# Altium project FlexEMG_v0r0.PrjPcb (part 1 of 2)
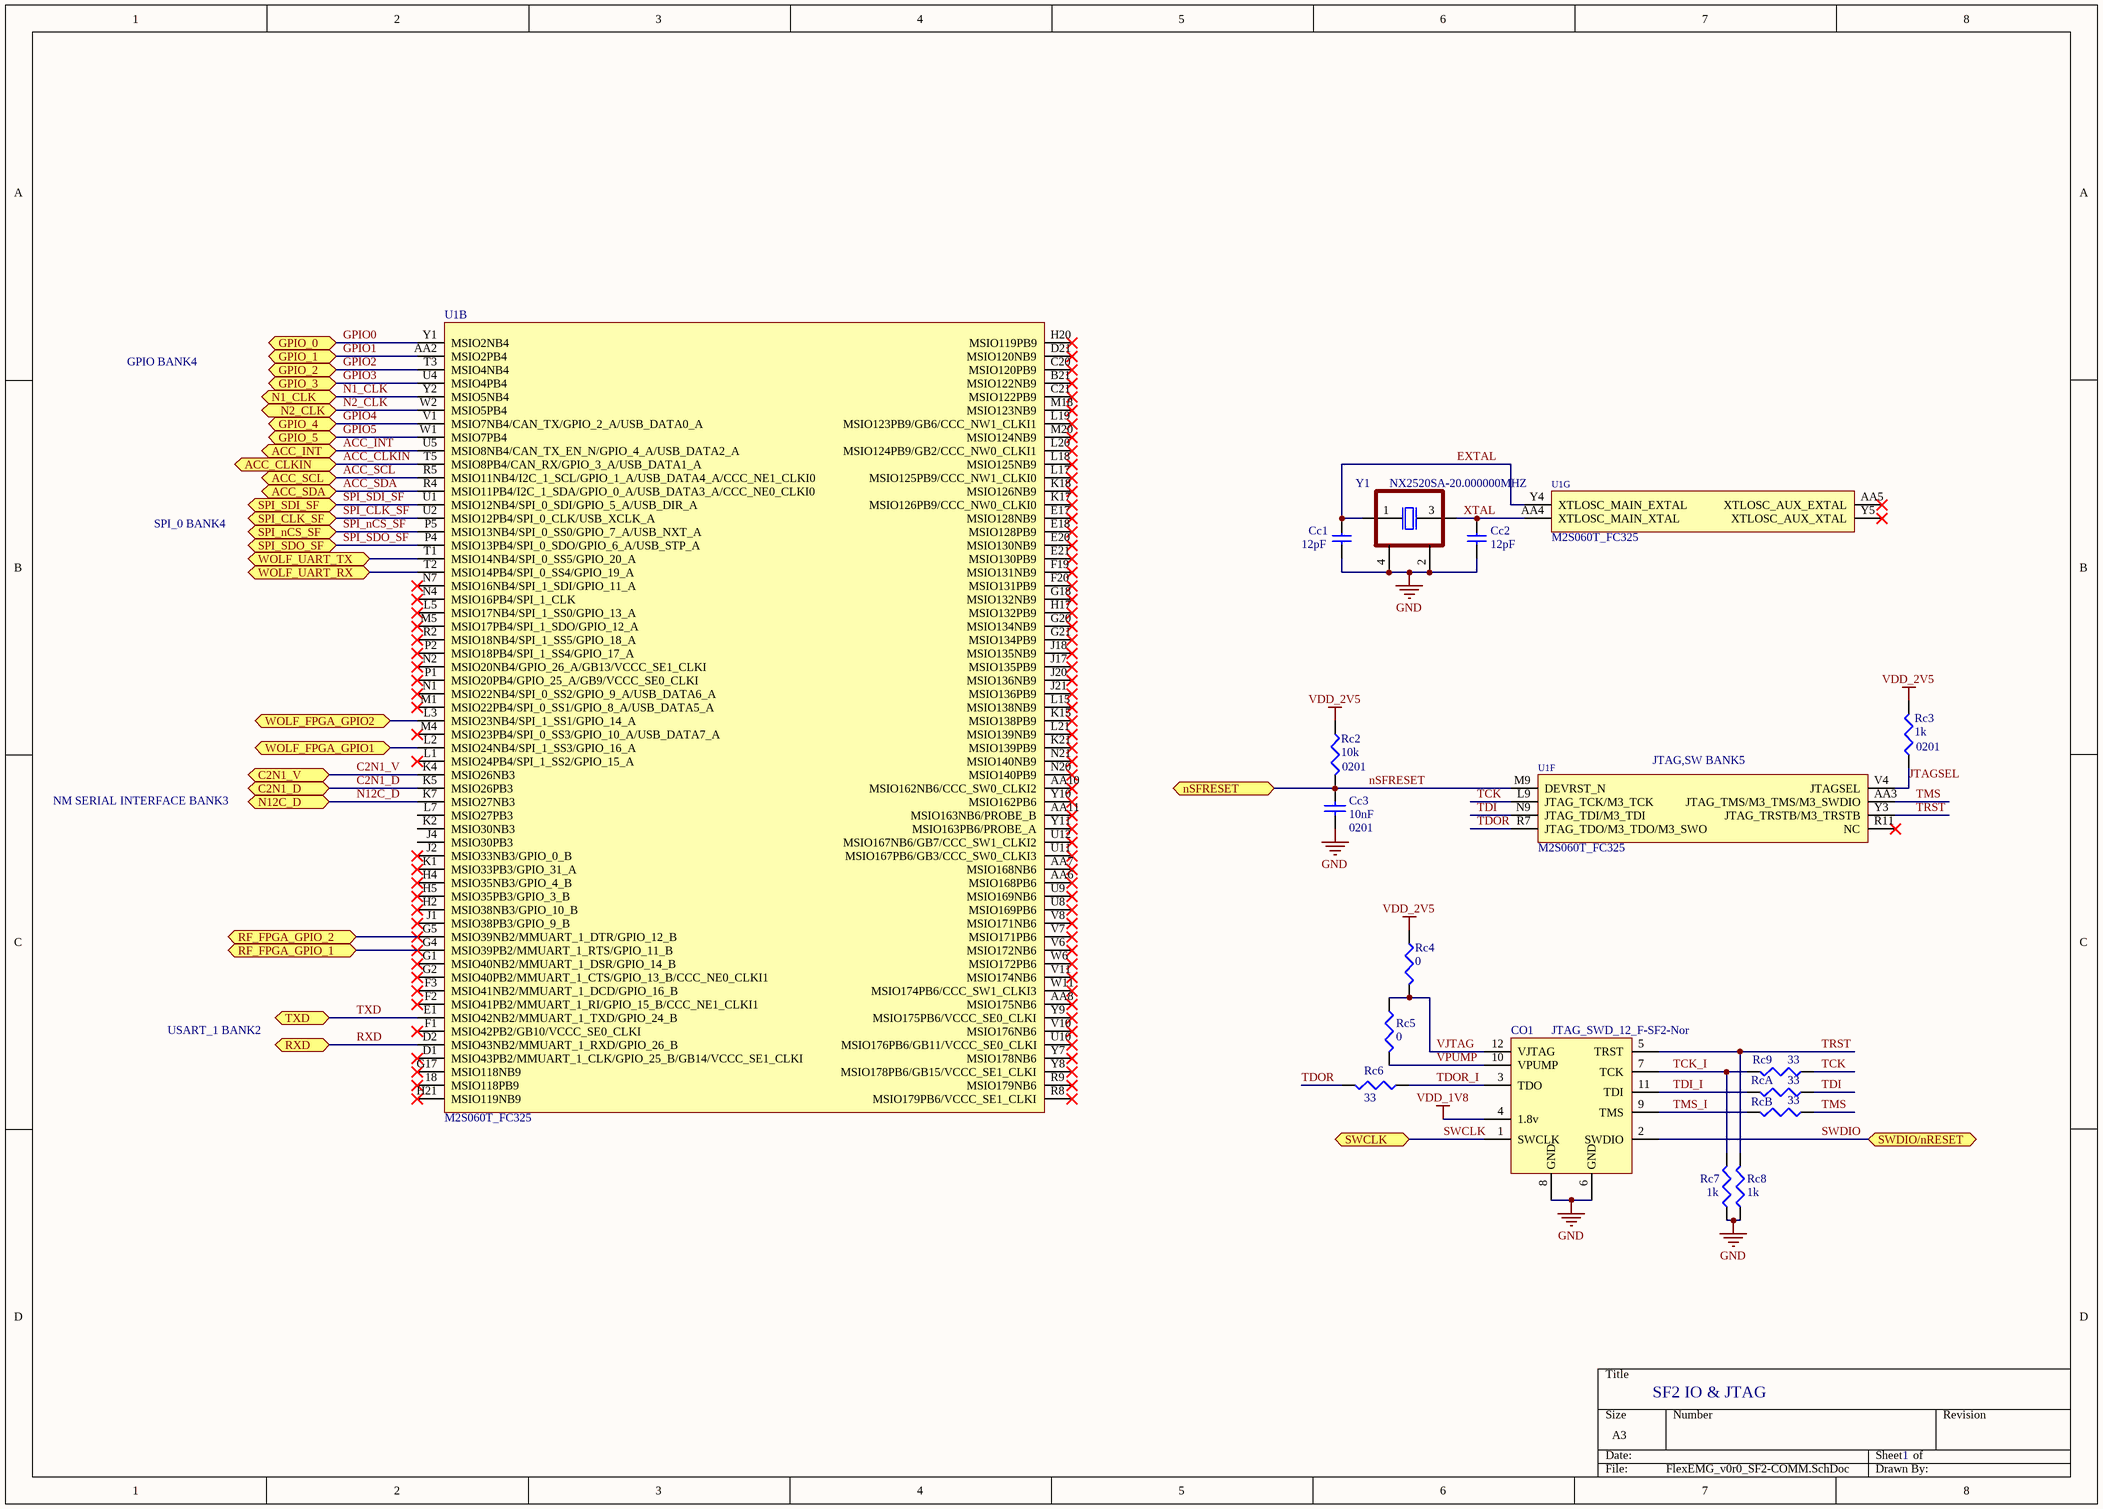
[diagram p0: FlexEMG_v0r0_SF2-COMM.SchDoc]
9 sheets, 200 parts. Net scope: flat (ports and power ports of the same name join across sheets).
Board file: FlexEMG_v0r0.PcbDoc
Sheets:
  FlexEMG_v0r0_SF2-COMM.SchDoc
  FlexEMG_v0r0_SF2_DDR.SchDoc
  FlexEMG_v0r0_SF2-POWER.SchDoc
  FlexEMG_v0r0_SF2_unused.SchDoc
  FlexEMG_v0r0_RADIO.SchDoc
  FlexEMG_v0r0_NM.SchDoc
  FlexEMG_v0r0_ACCEL.SchDoc
  FlexEMG_v0r0_BATT-CHARGER.SchDoc
  FlexEMG_v0r0_POWER-SUPPLIES.SchDoc

## Sheet FlexEMG_v0r0_SF2-COMM.SchDoc
size A3

### Parts
Cc1  value 12pF  [c0402-Murata-GR]  (hidden comment: GRM1555C1H120FA01D)
Cc2  value 12pF  [c0402-Murata-GR]  (hidden comment: GRM1555C1H120FA01D)
Cc3  0201  value 10nF  [c0201-Murata-GR]
CO1  JTAG_SWD_12_F-SF2-Nor  [CONN_12-CLP]
Rc2  value 10k  Package: 0201  [0201_p]  (hidden comment: ERJ-1GEF1002C)
Rc3  value 1k  Package: 0201  [0201_p]  (hidden comment: ERJ-1GEF1001C)
Rc4  value 0  [0402_p]  (hidden comment: ERJ-2GE0R00X)
Rc5  value 0  [0402_p]  (hidden comment: ERJ-2GE0R00X)
Rc6  value 33  [0402_p]  (hidden comment: ERJ-PA2J330X)
Rc7  value 1k  [0402_p]  (hidden comment: ERJ-2RKF1001X)
Rc8  value 1k  [0402_p]  (hidden comment: ERJ-2RKF1001X)
Rc9  value 33  [0402_p]  (hidden comment: ERJ-PA2J330X)
RcA  value 33  [0402_p]  (hidden comment: ERJ-PA2J330X)
RcB  value 33  [0402_p]  (hidden comment: ERJ-PA2J330X)
U1  M2S060T_FC325  [MCSM-CS-325]  (parts B,F,G of 9)
Y1  NX2520SA-20.000000MHZ  [XOSC_4PIN]

### Ports
ACC_CLKIN, ACC_INT, ACC_SCL, ACC_SDA, C2N1_D (bidir), C2N1_V (bidir), GPIO_0, GPIO_1, GPIO_2, GPIO_3, GPIO_4, GPIO_5, N1_CLK (bidir), N2_CLK (bidir), N12C_D (bidir), nSFRESET (bidir), RF_FPGA_GPIO_1 (bidir), RF_FPGA_GPIO_2 (bidir), RXD (bidir), SPI_CLK_SF (bidir), SPI_nCS_SF (bidir), SPI_SDI_SF (bidir), SPI_SDO_SF (bidir), SWCLK (bidir), SWDIO/nRESET (bidir), TXD (bidir), WOLF_FPGA_GPIO1 (bidir), WOLF_FPGA_GPIO2 (bidir), WOLF_UART_RX (bidir), WOLF_UART_TX (bidir)

### Nets
GND: Cc1.1 Cc2.1 Cc3.1 CO1.6(GND) CO1.8(GND) Rc7.1 Rc8.1 Y1.2(GND) Y1.4(GND)
VDD_1V8: CO1.4(1.8v)
VDD_2V5: Rc2.1 Rc3.2 Rc4.1
ACC_CLKIN: U1.T5(MSIO8PB4/CAN_RX/GPIO_3_A/USB_DATA1_A) ; port ACC_CLKIN
ACC_INT: U1.U5(MSIO8NB4/CAN_TX_EN_N/GPIO_4_A/USB_DATA2_A) ; port ACC_INT
ACC_SCL: U1.R5(MSIO11NB4/I2C_1_SCL/GPIO_1_A/USB_DATA4_A/CCC_NE1_CLKI0) ; port ACC_SCL
ACC_SDA: U1.R4(MSIO11PB4/I2C_1_SDA/GPIO_0_A/USB_DATA3_A/CCC_NE0_CLKI0) ; port ACC_SDA
C2N1_D: U1.K5(MSIO26PB3) ; port C2N1_D
C2N1_V: U1.K4(MSIO26NB3) ; port C2N1_V
EXTAL: Cc1.2 U1.Y4(XTLOSC_MAIN_EXTAL) Y1.1(inp)
GPIO0: U1.Y1(MSIO2NB4) ; port GPIO_0
GPIO1: U1.AA2(MSIO2PB4) ; port GPIO_1
GPIO2: U1.T3(MSIO4NB4) ; port GPIO_2
GPIO3: U1.U4(MSIO4PB4) ; port GPIO_3
GPIO4: U1.V1(MSIO7NB4/CAN_TX/GPIO_2_A/USB_DATA0_A) ; port GPIO_4
GPIO5: U1.W1(MSIO7PB4) ; port GPIO_5
JTAGSEL: Rc3.1 U1.V4(JTAGSEL)
N1_CLK: U1.Y2(MSIO5NB4) ; port N1_CLK
N2_CLK: U1.W2(MSIO5PB4) ; port N2_CLK
N12C_D: U1.K7(MSIO27NB3) ; port N12C_D
nSFRESET: Cc3.2 Rc2.2 U1.M9(DEVRST_N) ; port nSFRESET
RXD: U1.D2(MSIO43NB2/MMUART_1_RXD/GPIO_26_B) ; port RXD
SPI_CLK_SF: U1.U2(MSIO12PB4/SPI_0_CLK/USB_XCLK_A) ; port SPI_CLK_SF
SPI_nCS_SF: U1.P5(MSIO13NB4/SPI_0_SS0/GPIO_7_A/USB_NXT_A) ; port SPI_nCS_SF
SPI_SDI_SF: U1.U1(MSIO12NB4/SPI_0_SDI/GPIO_5_A/USB_DIR_A) ; port SPI_SDI_SF
SPI_SDO_SF: U1.P4(MSIO13PB4/SPI_0_SDO/GPIO_6_A/USB_STP_A) ; port SPI_SDO_SF
SWCLK: CO1.1(SWCLK) ; port SWCLK
SWDIO: CO1.2(SWDIO) ; port SWDIO/nRESET
TCK: Rc9.1 U1.L9(JTAG_TCK/M3_TCK)
TCK_I: CO1.7(TCK) Rc7.2 Rc9.2
TDI: RcA.1 U1.N9(JTAG_TDI/M3_TDI)
TDI_I: CO1.11(TDI) RcA.2
TDOR: Rc6.2 U1.R7(JTAG_TDO/M3_TDO/M3_SWO)
TDOR_I: CO1.3(TDO) Rc6.1
TMS: RcB.1 U1.AA3(JTAG_TMS/M3_TMS/M3_SWDIO)
TMS_I: CO1.9(TMS) RcB.2
TRST: CO1.5(TRST) Rc8.2 U1.Y3(JTAG_TRSTB/M3_TRSTB)
TXD: U1.E1(MSIO42NB2/MMUART_1_TXD/GPIO_24_B) ; port TXD
VJTAG: CO1.12(VJTAG) Rc4.2 Rc5.1
VPUMP: CO1.10(VPUMP) Rc5.2
XTAL: Cc2.2 U1.AA4(XTLOSC_MAIN_XTAL) Y1.3(out)
NetU1_G4: U1.G4(MSIO39PB2/MMUART_1_RTS/GPIO_11_B) ; port RF_FPGA_GPIO_1
NetU1_G5: U1.G5(MSIO39NB2/MMUART_1_DTR/GPIO_12_B) ; port RF_FPGA_GPIO_2
NetU1_L2: U1.L2(MSIO24NB4/SPI_1_SS3/GPIO_16_A) ; port WOLF_FPGA_GPIO1
NetU1_L3: U1.L3(MSIO23NB4/SPI_1_SS1/GPIO_14_A) ; port WOLF_FPGA_GPIO2
NetU1_T1: U1.T1(MSIO14NB4/SPI_0_SS5/GPIO_20_A) ; port WOLF_UART_TX
NetU1_T2: U1.T2(MSIO14PB4/SPI_0_SS4/GPIO_19_A) ; port WOLF_UART_RX

Not connected (* = marked no-connect by the designer): U1 18(MSIO118PB9)* AA5(XTLOSC_AUX_EXTAL)* AA6(MSIO168PB6)* AA7(MSIO168NB6)* AA8(MSIO175NB6)* AA10(MSIO162NB6/CCC_SW0_CLKI2)* AA11(MSIO163NB6/PROBE_B)* B21(MSIO122NB9)* C20(MSIO120PB9)* C21(MSIO122PB9)* D1(MSIO43PB2/MMUART_1_CLK/GPIO_25_B/GB14/VCCC_SE1_CLKI)* D21(MSIO120NB9)* E17(MSIO128NB9)* E18(MSIO128PB9)* E20(MSIO130NB9)* E21(MSIO130PB9)* F1(MSIO42PB2/GB10/VCCC_SE0_CLKI)* F2(MSIO41PB2/MMUART_1_RI/GPIO_15_B/CCC_NE1_CLKI1)* F3(MSIO41NB2/MMUART_1_DCD/GPIO_16_B)* F19(MSIO131NB9)* F20(MSIO131PB9)* G1(MSIO40NB2/MMUART_1_DSR/GPIO_14_B)* G2(MSIO40PB2/MMUART_1_CTS/GPIO_13_B/CCC_NE0_CLKI1)* G17(MSIO118NB9)* G18(MSIO132NB9)* G20(MSIO134NB9)* G21(MSIO134PB9)* H2(MSIO38NB3/GPIO_10_B)* H4(MSIO35NB3/GPIO_4_B)* H5(MSIO35PB3/GPIO_3_B)* H17(MSIO132PB9)* H20(MSIO119PB9)* H21(MSIO119NB9)* J1(MSIO38PB3/GPIO_9_B)* J2(MSIO33NB3/GPIO_0_B)* J4(MSIO30PB3) J17(MSIO135PB9)* J18(MSIO135NB9)* J20(MSIO136NB9)* J21(MSIO136PB9)* K1(MSIO33PB3/GPIO_31_A)* K2(MSIO30NB3) K15(MSIO138PB9)* K17(MSIO126PB9/CCC_NW0_CLKI0)* K18(MSIO126NB9)* K21(MSIO139PB9)* L1(MSIO24PB4/SPI_1_SS2/GPIO_15_A)* L5(MSIO17NB4/SPI_1_SS0/GPIO_13_A)* L7(MSIO27PB3) L15(MSIO138NB9)* L17(MSIO125PB9/CCC_NW1_CLKI0)* L18(MSIO125NB9)* L19(MSIO123PB9/GB6/CCC_NW1_CLKI1)* L20(MSIO124PB9/GB2/CCC_NW0_CLKI1)* L21(MSIO139NB9)* M1(MSIO22PB4/SPI_0_SS1/GPIO_8_A/USB_DATA5_A)* M4(MSIO23PB4/SPI_0_SS3/GPIO_10_A/USB_DATA7_A)* M5(MSIO17PB4/SPI_1_SDO/GPIO_12_A)* M18(MSIO123NB9)* M20(MSIO124NB9)* N1(MSIO22NB4/SPI_0_SS2/GPIO_9_A/USB_DATA6_A)* N2(MSIO20NB4/GPIO_26_A/GB13/VCCC_SE1_CLKI)* N4(MSIO16PB4/SPI_1_CLK)* N7(MSIO16NB4/SPI_1_SDI/GPIO_11_A)* N20(MSIO140PB9)* N21(MSIO140NB9)* P1(MSIO20PB4/GPIO_25_A/GB9/VCCC_SE0_CLKI)* P2(MSIO18PB4/SPI_1_SS4/GPIO_17_A)* R2(MSIO18NB4/SPI_1_SS5/GPIO_18_A)* R8(MSIO179PB6/VCCC_SE1_CLKI)* R9(MSIO179NB6)* R11(NC)* U8(MSIO169PB6)* U9(MSIO169NB6)* U10(MSIO176PB6/GB11/VCCC_SE0_CLKI)* U11(MSIO167PB6/GB3/CCC_SW0_CLKI3)* U12(MSIO167NB6/GB7/CCC_SW1_CLKI2)* V6(MSIO172NB6)* V7(MSIO171PB6)* V8(MSIO171NB6)* V10(MSIO176NB6)* V11(MSIO174NB6)* W6(MSIO172PB6)* W11(MSIO174PB6/CCC_SW1_CLKI3)* Y5(XTLOSC_AUX_XTAL)* Y7(MSIO178NB6)* Y8(MSIO178PB6/GB15/VCCC_SE1_CLKI)* Y9(MSIO175PB6/VCCC_SE0_CLKI)* Y10(MSIO162PB6)* Y11(MSIO163PB6/PROBE_A)*

### Notes on the sheet
- GPIO BANK4
- SPI_0 BANK4
- (near U1) JTAG,SW BANK5
- NM SERIAL INTERFACE BANK3
- USART_1 BANK2
- SF2 IO & JTAG
- 1

### Library data of the parts
Cc1 Cc2 = CAP_0402: CAP CER 12PF 50V NP0 0402; Manufacturer: Murata; Supplier: Digikey; Manufacturer PN: GRM1555C1H120FA01D; Supplier PN: 490-6196-1-ND
Cc3 = Cap: CAP CER 10000PF 25V X5R 0201; Manufacturer: Murata; Manufacturer PN: GRM033R61E103KA12D; Supplier: Digikey; Supplier PN: 490-7194-1-ND
CO1 = JTAG_SWD_12_F-SF2-Nor: 12 pin female JTAG/SWD header for SmartFusion2 and Nordic; Manufacturer: Samtec; Manufacturer PN: CLP-106-02-x-D; Supplier: Digikey; Supplier PN: SAM1153-06-ND
Rc2 = Resistor: RES SMD 10K OHM 1% 1/20W 0201; Manufacturer: Panasonic; Manufacturer PN: ERJ-1GEF1002C; Supplier: Digikey; Supplier P/N: P10.0KABCT-ND; Power: 1/20W
Rc3 = Resistor: RES SMD 1K OHM 1% 1/20W 0201; Manufacturer: Panasonic; Manufacturer PN: ERJ-1GEF1001C; Supplier: Digikey; Supplier P/N: P1.00KABCT-ND; Power: 1/20W
Rc4 Rc5 = Resistor: RES SMD 0.0OHM JUMPER 1/10W 0402; Manufacturer: Panasonic; Manufacturer PN: ERJ-2GE0R00X; Supplier: Digikey; Power: 1/10W; Supplier P/N: P0.0JCT-ND; Package: 0402
Rc6 Rc9 RcA RcB = Resistor: RES SMD 33 OHM 1% 1/10W 0402; Manufacturer: Panasonic; Power: 1/5W; Manufacturer PN: ERJ-PA2J330X; Supplier: Digikey; Supplier P/N: P17184CT-ND; Package: 0402
Rc7 Rc8 = Resistor: RES SMD 1K OHM 1% 1/10W 0402; Manufacturer: Panasonic; Manufacturer PN: ERJ-2RKF1001X; Supplier: Digikey; Supplier P/N: P1.00KLCT-ND; Power: 1/10W; Package: 0402
U1 = M2S060T_FC325: SmartFusion2; Manufacturer PN: M2S060T-CS325; Manufacturer: Microsemi; Supplier: Future; Supplier PN: M2S060T-FCSG325I
Y1 = XOSC: CRYSTAL 20.0000MHZ 10PF SMD; Manufacturer: NDK; Supplier PN: 644-1060-6-ND; Supplier: Digikey; Manufacturer PN: NX2520SA-20.000000MHZ

## Sheet FlexEMG_v0r0_SF2_DDR.SchDoc
size A3
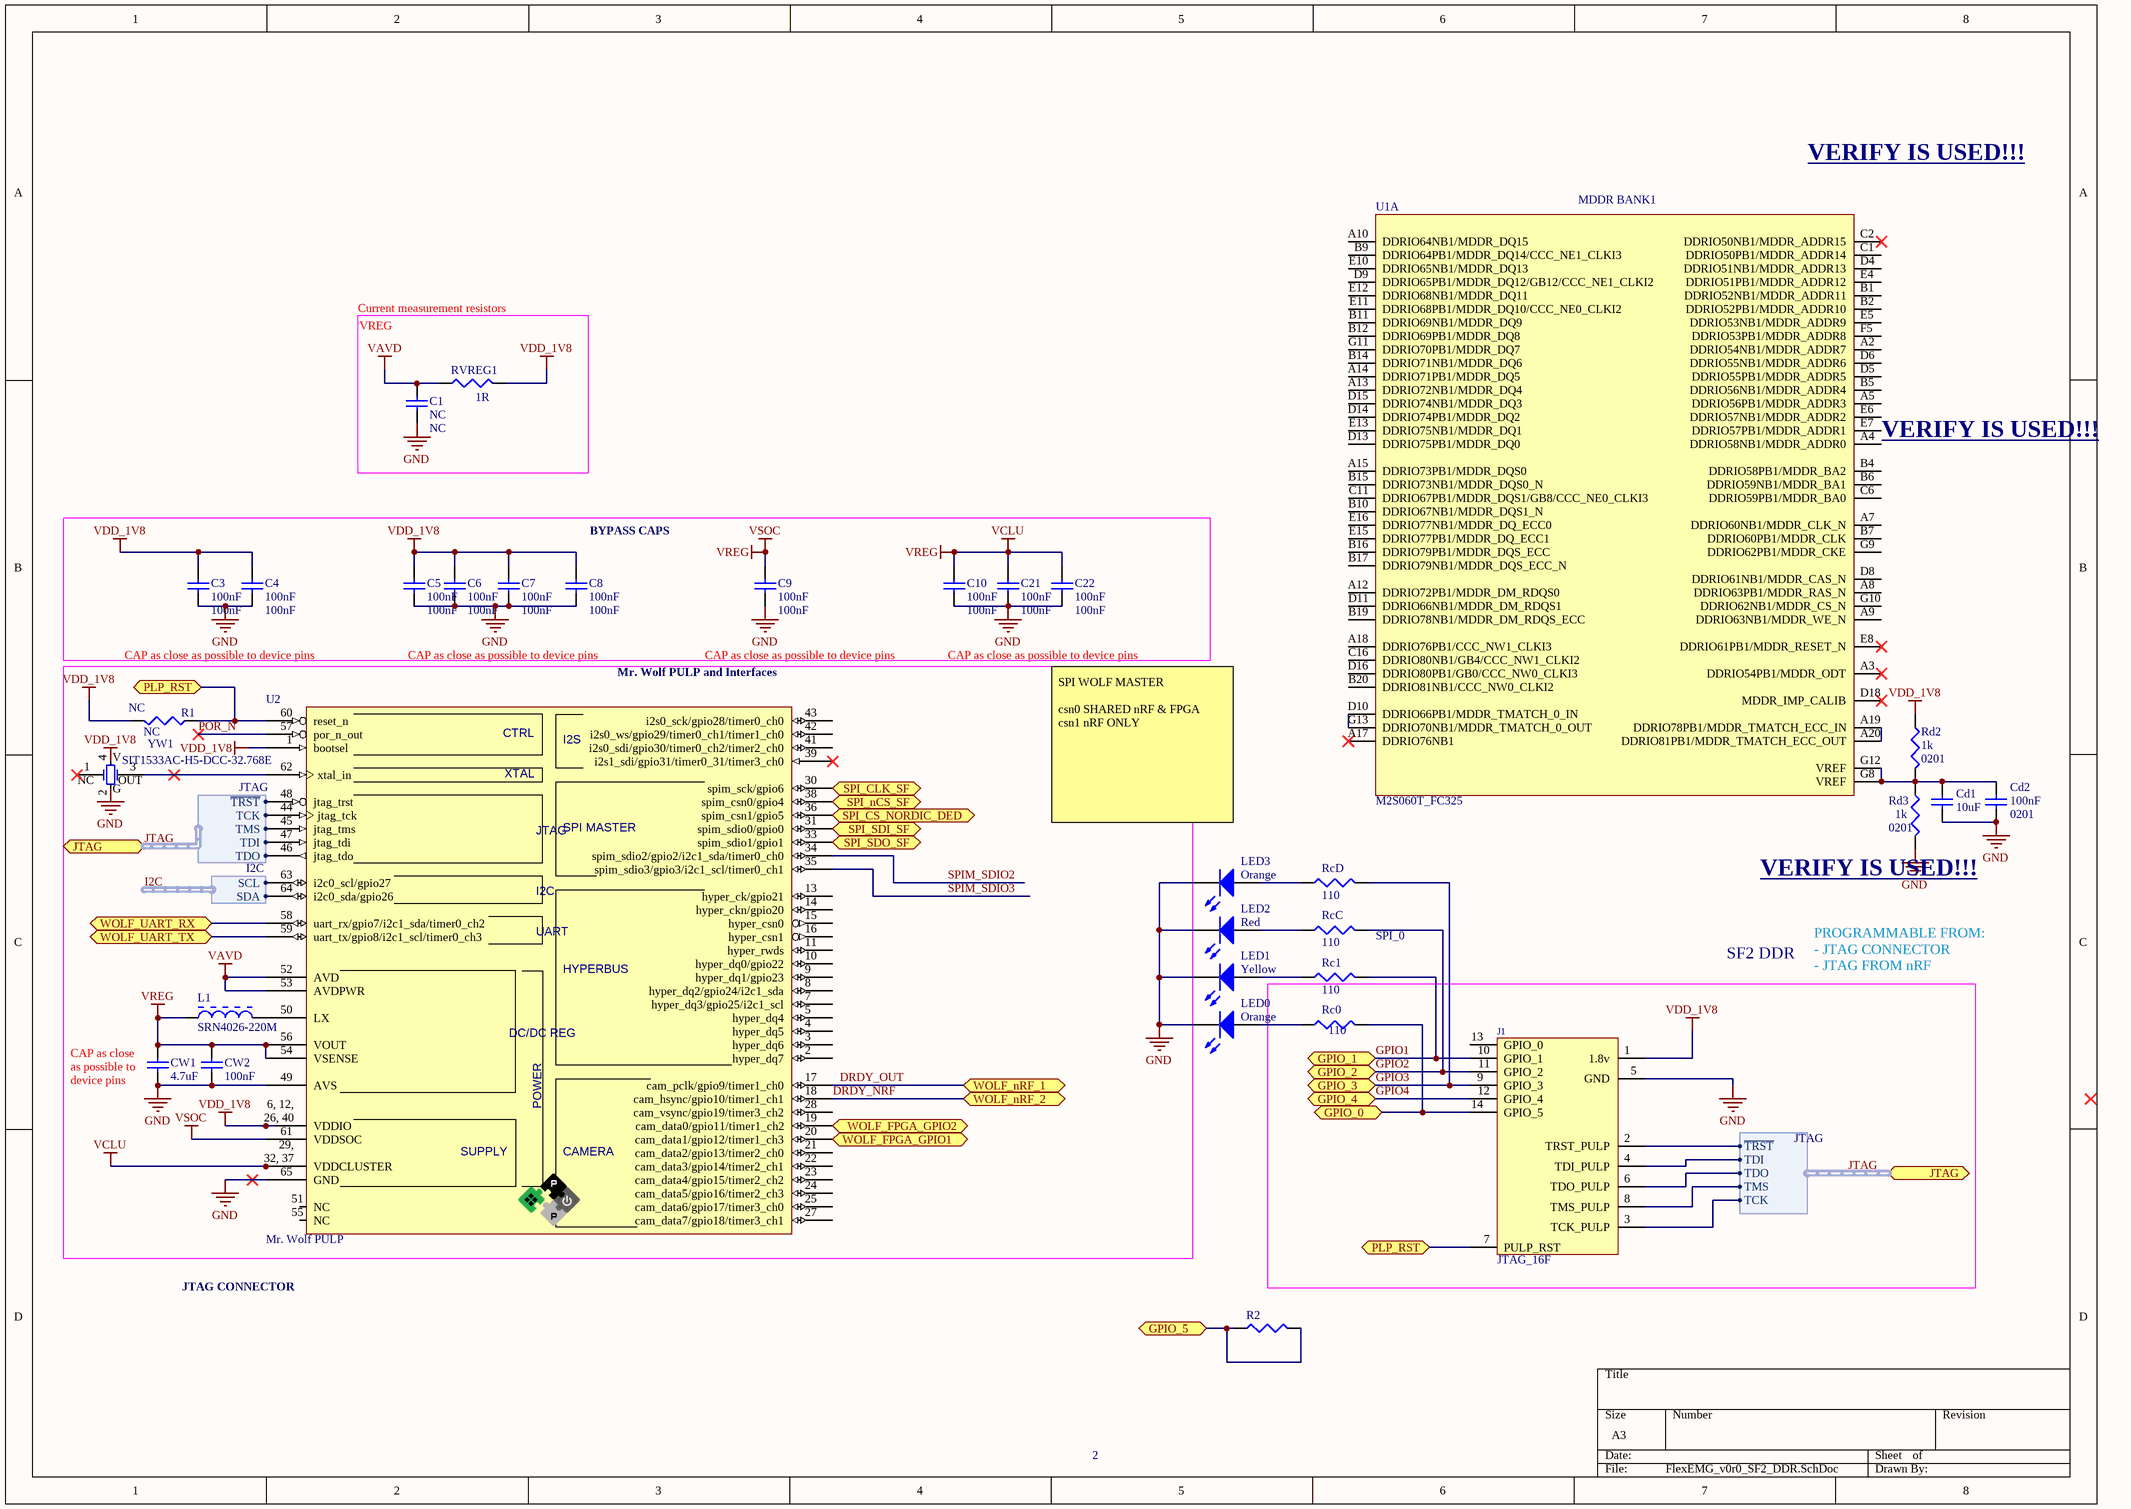
[diagram p1: FlexEMG_v0r0_SF2_DDR.SchDoc]

### Parts
C1  NC  [J1-0603]
C3  100nF  [0402]
C4  100nF  [0402_ss]
C5  100nF  [0402]
C6  100nF  [0402]
C7  100nF  [0402]
C8  100nF  [0402]
C9  100nF  [0402]
C10  100nF  [0402]
C21  100nF  [0402]
C22  100nF  [0402]
Cd1  value 10uF  [c0603-Murata-GR]  (hidden comment: GRM188R61E106MA73D)
Cd2  value 100nF  Package: 0201  [c0201-Murata-GR]  (hidden comment: GRM033R6YA104KE14D)
CW1  4.7uF  [0402]
CW2  100nF  [0402]
J1  JTAG_16F  [CONN_16-CLP]
L1  SRN4026-220M  [BOUR-IND-SRN4026]
LED0  Color: Orange  [LED-0603]
LED1  Color: Yellow  [LED-0603]
LED2  Color: Red  [LED-0603]
LED3  Color: Orange  [LED-0603]
R1  NC  [0402]
R2  (no value)  [0603]
Rc0  value 110  [0201_p]  (hidden comment: ERJ-2RKF1100X)
Rc1  value 110  [0201_p]  (hidden comment: ERJ-2RKF1100X)
RcC  value 110  [0201_p]  (hidden comment: ERJ-2RKF1100X)
RcD  value 110  [0201_p]  (hidden comment: ERJ-2RKF1100X)
Rd2  value 1k  Package: 0201  [0201_p]  (hidden comment: ERJ-1GEF1001C)
Rd3  value 1k  Package: 0201  [0201_p]  (hidden comment: ERJ-1GEF1001C)
RVREG1  value 1R  [J1-0603]
U1  M2S060T_FC325  [MCSM-CS-325]  (part A of 9)
U2  Mr. Wolf PULP  [QFN50P900X900X100_HS_NOVIAS_65M]
YW1  SIT1533AC-H5-DCC-32.768E  [SiT1533-C]

### Blocks framed on the sheet
BYPASS CAPS: C3-C10 C21 C22
Mr. Wolf PULP and Interfaces: CW1 CW2 L1 R1 U2 YW1

### Ports
GPIO_0, GPIO_1, GPIO_2, GPIO_3, GPIO_4, GPIO_5, JTAG (harness JTAG), PLP_RST (bidir), SPI_CLK_SF (bidir), SPI_CS_NORDIC_DED (bidir), SPI_nCS_SF (bidir), SPI_SDI_SF (bidir), SPI_SDO_SF (bidir), WOLF_FPGA_GPIO1 (bidir), WOLF_FPGA_GPIO2 (bidir), WOLF_nRF_1 (bidir), WOLF_nRF_2 (bidir), WOLF_UART_RX (bidir), WOLF_UART_TX (bidir)

### Harnesses
JTAG: ~{TRST}, TCK, TMS, TDI, TDO
I2C: SCL, SDA

### Nets
GND: C1.1 C3.1 C4.1 C5.1 C6.1 C7.1 C8.1 C9.1 C10.1 C21.1 C22.1 Cd1.1 Cd2.1 CW1.1 CW2.1 J1.5(GND) LED0.2(K) LED1.2(K) LED2.2(K) LED3.2(K) Rd3.2 U2.49(AVS) U2.65(GND) YW1.2(GND)
VAVD: C1.2 RVREG1.1 U2.52(AVD) U2.53(AVDPWR)
VCLU: C9.2 C10.2 C21.2 C22.2 CW1.2 CW2.2 L1.1 U2.29(VDDCLUSTER) U2.32(VDDCLUSTER) U2.37(VDDCLUSTER) U2.54(VSENSE) U2.56(VOUT) U2.61(VDDSOC)  [also labelled VREG, VSOC]
VDD_1V8: C3.2 C4.2 C5.2 C6.2 C7.2 C8.2 J1.1(1.8v) R1.2 Rd2.1 RVREG1.2 U2.1(bootsel) U2.6(VDDIO) U2.12(VDDIO) U2.26(VDDIO) U2.40(VDDIO) YW1.4(VDD)
DRDY_NRF: U2.18(cam_hsync/gpio10/timer1_ch1) ; port WOLF_nRF_2
DRDY_OUT: U2.17(cam_pclk/gpio9/timer1_ch0) ; port WOLF_nRF_1
GPIO0: J1.14(GPIO_5) Rc0.2 ; port GPIO_0
GPIO1: J1.10(GPIO_1) Rc1.2 ; port GPIO_1
GPIO2: J1.11(GPIO_2) RcC.2 ; port GPIO_2
GPIO3: J1.9(GPIO_3) RcD.2 ; port GPIO_3
GPIO4: J1.12(GPIO_4) ; port GPIO_4
GPIO5: R2.1 R2.2 ; port GPIO_5
I2C.SCL: U2.63(i2c0_scl/gpio27) ; harness I2C.SCL
I2C.SDA: U2.64(i2c0_sda/gpio26) ; harness I2C.SDA
JTAG.~{TRST}: J1.2(TRST_PULP) U2.48(jtag_trst) ; port JTAG.~{TRST}
JTAG.TCK: J1.3(TCK_PULP) U2.44(jtag_tck) ; port JTAG.TCK
JTAG.TDI: J1.4(TDI_PULP) U2.47(jtag_tdi) ; port JTAG.TDI
JTAG.TDO: J1.6(TDO_PULP) U2.46(jtag_tdo) ; port JTAG.TDO
JTAG.TMS: J1.8(TMS_PULP) U2.45(jtag_tms) ; port JTAG.TMS
POR_N: U2.57(por_n_out)
SPI_CLK_SF: U2.30(spim_sck/gpio6) ; port SPI_CLK_SF
SPI_nCS_SF: U2.38(spim_csn0/gpio4) ; port SPI_nCS_SF
SPI_SDI_SF: U2.31(spim_sdio0/gpio0) ; port SPI_SDI_SF
SPI_SDO_SF: U2.33(spim_sdio1/gpio1) ; port SPI_SDO_SF
SPIM_SDIO2: U2.34(spim_sdio2/gpio2/i2c1_sda/timer0_ch0)
SPIM_SDIO3: U2.35(spim_sdio3/gpio3/i2c1_scl/timer0_ch1)
NetCd1_2: Cd1.2 Cd2.2 Rd2.2 Rd3.1 U1.G8(VREF) U1.G12(VREF)
NetJ1_7: J1.7(PULP_RST) R1.1 U2.60(reset_n) ; port PLP_RST
NetL1_2: L1.2 U2.50(LX)
NetLED0_1: LED0.1(A) Rc0.1
NetLED1_1: LED1.1(A) Rc1.1
NetLED2_1: LED2.1(A) RcC.1
NetLED3_1: LED3.1(A) RcD.1
NetU1_A19: U1.A19(DDRIO78PB1/MDDR_TMATCH_ECC_IN) U1.A20(DDRIO81PB1/MDDR_TMATCH_ECC_OUT)
NetU1_D10: U1.D10(DDRIO66PB1/MDDR_TMATCH_0_IN) U1.G13(DDRIO70NB1/MDDR_TMATCH_0_OUT)
NetU1_L2: U2.20(cam_data1/gpio12/timer1_ch3) ; port WOLF_FPGA_GPIO1
NetU1_L3: U2.19(cam_data0/gpio11/timer1_ch2) ; port WOLF_FPGA_GPIO2
NetU1_T1: U2.59(uart_tx/gpio8/i2c1_scl/timer0_ch3) ; port WOLF_UART_TX
NetU1_T2: U2.58(uart_rx/gpio7/i2c1_sda/timer0_ch2) ; port WOLF_UART_RX
NetU2_36: U2.36(spim_csn1/gpio5) ; port SPI_CS_NORDIC_DED
NetU2_62: U2.62(xtal_in) YW1.3(OUT)

Not connected (* = marked no-connect by the designer): J1 13(GPIO_0); U1 A2(DDRIO54NB1/MDDR_ADDR7) A3(DDRIO54PB1/MDDR_ODT)* A4(DDRIO58NB1/MDDR_ADDR0) A5(DDRIO56PB1/MDDR_ADDR3) A7(DDRIO60NB1/MDDR_CLK_N) A8(DDRIO63PB1/MDDR_RAS_N) A9(DDRIO63NB1/MDDR_WE_N) A10(DDRIO64NB1/MDDR_DQ15) A12(DDRIO72PB1/MDDR_DM_RDQS0) A13(DDRIO72NB1/MDDR_DQ4) A14(DDRIO71PB1/MDDR_DQ5) A15(DDRIO73PB1/MDDR_DQS0) A17(DDRIO76NB1)* A18(DDRIO76PB1/CCC_NW1_CLKI3) B1(DDRIO52NB1/MDDR_ADDR11) B2(DDRIO52PB1/MDDR_ADDR10) B4(DDRIO58PB1/MDDR_BA2) B5(DDRIO56NB1/MDDR_ADDR4) B6(DDRIO59NB1/MDDR_BA1) B7(DDRIO60PB1/MDDR_CLK) B9(DDRIO64PB1/MDDR_DQ14/CCC_NE1_CLKI3) B10(DDRIO67NB1/MDDR_DQS1_N) B11(DDRIO69NB1/MDDR_DQ9) B12(DDRIO69PB1/MDDR_DQ8) B14(DDRIO71NB1/MDDR_DQ6) B15(DDRIO73NB1/MDDR_DQS0_N) B16(DDRIO79PB1/MDDR_DQS_ECC) B17(DDRIO79NB1/MDDR_DQS_ECC_N) B19(DDRIO78NB1/MDDR_DM_RDQS_ECC) B20(DDRIO81NB1/CCC_NW0_CLKI2) C1(DDRIO50PB1/MDDR_ADDR14) C2(DDRIO50NB1/MDDR_ADDR15)* C6(DDRIO59PB1/MDDR_BA0) C11(DDRIO67PB1/MDDR_DQS1/GB8/CCC_NE0_CLKI3) C16(DDRIO80NB1/GB4/CCC_NW1_CLKI2) D4(DDRIO51NB1/MDDR_ADDR13) D5(DDRIO55PB1/MDDR_ADDR5) D6(DDRIO55NB1/MDDR_ADDR6) D8(DDRIO61NB1/MDDR_CAS_N) D9(DDRIO65PB1/MDDR_DQ12/GB12/CCC_NE1_CLKI2) D11(DDRIO66NB1/MDDR_DM_RDQS1) D13(DDRIO75PB1/MDDR_DQ0) D14(DDRIO74PB1/MDDR_DQ2) D15(DDRIO74NB1/MDDR_DQ3) D16(DDRIO80PB1/GB0/CCC_NW0_CLKI3) D18(MDDR_IMP_CALIB)* E4(DDRIO51PB1/MDDR_ADDR12) E5(DDRIO53NB1/MDDR_ADDR9) E6(DDRIO57NB1/MDDR_ADDR2) E7(DDRIO57PB1/MDDR_ADDR1) E8(DDRIO61PB1/MDDR_RESET_N)* E10(DDRIO65NB1/MDDR_DQ13) E11(DDRIO68PB1/MDDR_DQ10/CCC_NE0_CLKI2) E12(DDRIO68NB1/MDDR_DQ11) E13(DDRIO75NB1/MDDR_DQ1) E15(DDRIO77PB1/MDDR_DQ_ECC1) E16(DDRIO77NB1/MDDR_DQ_ECC0) F5(DDRIO53PB1/MDDR_ADDR8) G9(DDRIO62PB1/MDDR_CKE) G10(DDRIO62NB1/MDDR_CS_N) G11(DDRIO70PB1/MDDR_DQ7); U2 2(hyper_dq7) 3(hyper_dq6) 4(hyper_dq5) 5(hyper_dq4) 7(hyper_dq3/gpio25/i2c1_scl) 8(hyper_dq2/gpio24/i2c1_sda) 9(hyper_dq1/gpio23) 10(hyper_dq0/gpio22) 11(hyper_rwds) 13(hyper_ck/gpio21) 14(hyper_ckn/gpio20) 15(hyper_csn0) 16(hyper_csn1) 21(cam_data2/gpio13/timer2_ch0) 22(cam_data3/gpio14/timer2_ch1) 23(cam_data4/gpio15/timer2_ch2) 24(cam_data5/gpio16/timer2_ch3) 25(cam_data6/gpio17/timer3_ch0) 27(cam_data7/gpio18/timer3_ch1) 28(cam_vsync/gpio19/timer3_ch2) 39(i2s1_sdi/gpio31/timer0_31/timer3_ch0)* 41(i2s0_sdi/gpio30/timer0_ch2/timer2_ch0) 42(i2s0_ws/gpio29/timer0_ch1/timer1_ch0) 43(i2s0_sck/gpio28/timer0_ch0) 51(NC) 55(NC); YW1 1(NC)*

### Buses and harness runs
harness JTAG = port JTAG

### Notes on the sheet
- VERIFY IS USED!!!
- (near U1) MDDR BANK1
- Current measurement resistors
- VREG
- (near U1) VERIFY IS USED!!!
- CAP as close as possible to device pins
- SPI WOLF MASTER
  csn0 SHARED nRF & FPGA
  csn1 nRF ONLY
- (near Rd3) VERIFY IS USED!!!
- (near RcC) SPI_0
- SF2 DDR
- PROGRAMMABLE FROM:
  - JTAG CONNECTOR
  - JTAG FROM nRF
- (near CW1) CAP as close as possible to device pins
- JTAG CONNECTOR
- 2
- (in symbol PULP_MR_WOLF) CTRL; I2S; XTAL; JTAG; SPI MASTER; I2C; UART; HYPERBUS; DC/DC REG; POWER; 6, 12,; 26, 40; 29,; SUPPLY; CAMERA; 32, 37
- (in symbol SIT-OSC32KHZ-SIT1533AC-H5-DCC-32.768) V; G

### Library data of the parts
C1 C3-C10 C21 C22 = Cap Semi: Capacitor (Semiconductor SIM Model); Published: 8-Jun-2000; LatestRevisionDate: 29-May-2009; LatestRevisionNote: IPC-7351 Footprint Added.; PackageReference: C1206; Publisher: Altium Limited; PackageDescription: Chip Capacitor
  C1: Value: NC
  C3-C10 C21 C22: Value: 100nF
Cd1 = Cap: CAP CER 10UF 25V X5R 0603 20%; Manufacturer: Murata; Supplier: Digikey; Supplier PN: 490-7202-1-ND; Manufacturer PN: GRM188R61E106MA73D
Cd2 = Cap: CAP CER 0.1UF 16V X7S 0201; Manufacturer: Murata; Note: 35V 10% X5R; Supplier PN: 490-10430-1-ND; Supplier: Digikey; Manufacturer PN: GRM033R6YA104KE14D
CW1 CW2 = Cap Semi: Capacitor (Semiconductor SIM Model); Value: 100pF; Published: 8-Jun-2000; LatestRevisionDate: 29-May-2009; LatestRevisionNote: IPC-7351 Footprint Added.; PackageReference: C1206; Publisher: Altium Limited; PackageDescription: Chip Capacitor
J1 = JTAG_16F: 12 pin female JTAG/SWD header for SmartFusion2 and Nordic; Manufacturer: Samtec; Manufacturer PN: CLP-105-02-x-D; Supplier: Digikey; Supplier PN: SAM1153-05-ND
L1 = BOUR-IND-SRN4026-220M: Semi-shielded Power Inductor, 22uH, 3A; Manufacturer: Bourns; Core Material: Ferrite; Tolerance: 20%; Current Rating: 670mA; DC Resistance (DCR): 234mR; Self Resonant Frequency: 16MHz; Test Frequency: 100kHz; ComponentLink1URL: https://www.bourns.com/docs/Product-Datasheets/SRN4026.pdf; ComponentLink1Description: Datasheet; Supplier 1: RSComponents; Supplier Part Number 1: 813-5643P; Manufacturer Part Number: SRN4026-220M; Stock 1: 2770; Pricing 1: 100=0.209, 500=0.176, 3000=0.135, 6000=0.132 (EUR); Mount: Surface Mount; Case/Package: Nonstandard; Weight: 0.004938oz; Min Operating Temperature: -40°C; Max Operating Temperature: 125°C; Packaging: Tape and Reel; Composition: Wirewound; Inductance: 22uh; Saturation Current: 670mA; Shielding: Shielded; Max DC Current: 670mA; Termination: SMD/SMT; RMS Current (Irms): 670mA; Inductance Tolerance: 20%; Package Quantity: 3000; Length: 4mm; Height: 2.5mm; Width: 4mm; Height - Seated (Max): 0.098inch; Depth: 4mm; REACH SVHC: No SVHC; ComponentLink2URL: https://datasheet.ciiva.com/48684/srn4026-48684665.pdf; ComponentLink2Description: https://datasheet.ciiva.com/48684/srn4026-48684665.pdf; ComponentLink3URL: https://datasheet.ciiva.com/46641/70371276-46641103.pdf; ComponentLink3Description: https://datasheet.ciiva.com/46641/70371276-46641103.pdf; Supplier 2: Farnell; Supplier Part Number 2: 2428221; Stock 2: 402; Pricing 2: 5=0.298, 50=0.217, 250=0.175, 500=0.16, 1500=0.155, 3000=0.151, 15000=0.146 (EUR); Supplier 3: Digi-Key; Supplier Part Number 3: SRN4026-220MTR-ND; Stock 3: 0; Pricing 3: 3000=0.144, 6000=0.1395, 15000=0.135, 30000=0.133 (USD); Supplier 4: Digi-Key; Supplier Part Number 4: SRN4026-220MDKR-ND; Stock 4: 863; Pricing 4: 1=0.41, 10=0.362, 100=0.2588, 500=0.2174, 1000=0.176 (USD); Supplier 5: Mouser; Supplier Part Number 5: 652-SRN4026-220M; Stock 5: 140; Pricing 5: 1=0.36, 10=0.246, 50=0.246, 100=0.224, 1000=0.152, 10000=0.122 (USD); Supplier 6: Digi-Key; Supplier Part Number 6: SRN4026-220MCT-ND; Stock 6: 863; Pricing 6: 1=0.41, 10=0.362, 100=0.2588, 500=0.2174, 1000=0.176 (USD); Supplier 7: RSComponents; Supplier Part Number 7: 8135643; Stock 7: 1990; Pricing 7: 10=0.227, 100=0.216, 500=0.19, 3000=0.13, 6000=0.12 (GBP); Supplier 8: Distrelec; Supplier Part Number 8: SRN4026-220M; Stock 8: 3000; Pricing 8: 1=0.6667, 10=0.5, 100=0.3333, 500=0.2857 (EUR); Supplier 9: Farnell; Supplier Part Number 9: 2428221RL; Stock 9: 930; Pricing 9: 50=0.209, 250=0.165, 500=0.15, 1500=0.122, 3000=0.117, 15000=0.106, 30000=0.104 (GBP); Supplier 10: Distrelec; Supplier Part Number 10: 30026188; Stock 10: 2895; Pricing 10: 1=0.214, 10=0.1299, 50=0.1266, 250=0.1203, 500=0.1173, 2500=0.1145 (EUR); Supplier 11: RSComponents; Supplier Part Number 11: 813-5643; Stock 11: 2000; Pricing 11: 10=0.227, 100=0.216 (GBP)
LED0 LED3 = LED: LED ORANGE CLEAR 0603 SMD; Manufacturer: Rohm; Manufacturer PN: SML-311DTT86; Supplier: Digikey; Supplier PN: 511-1303-1-ND
LED1 = LED: LED YELLOW CLEAR 0603 SMD; Manufacturer: Rohm; Manufacturer PN: SML-311YTT86; Supplier: Digikey; Supplier PN: 511-1305-1-ND
LED2 = LED: LED RED CLEAR 0603 SMD; Manufacturer: Rohm; Manufacturer PN: SML-311UTT86; Supplier: Digikey; Supplier PN: 511-1304-1-ND
R1 RVREG1 = Res3: Resistor; Published: 8-Jun-2000; LatestRevisionDate: 29-May-2009; LatestRevisionNote: IPC-7351 Footprint Added.; PackageReference: J1-0603; Publisher: Altium Limited; PackageDescription: Chip Resistor
  R1: Value: NC
R2 = Resistor: Supplier: Digikey; Manufacturer: *
Rc0 Rc1 RcC RcD = Resistor: RES SMD 110 OHM 1% 1/10W 0402; Manufacturer: Panasonic; Manufacturer PN: ERJ-2RKF1100X; Supplier: Digikey; Supplier P/N: P110LCT-ND; Power: 1/10W; Package: 0402
Rd2 Rd3 = Resistor: as Rc3 on sheet FlexEMG_v0r0_SF2-COMM; Manufacturer PN: ERJ-1GEF1001C; Supplier: Digikey; Supplier P/N: P1.00KABCT-ND; Power: 1/20W
U1 = M2S060T_FC325: as U1 on sheet FlexEMG_v0r0_SF2-COMM; Supplier: Future; Supplier PN: M2S060T-FCSG325I
U2 = PULP_MR_WOLF: Mr. Wolf PULP Heterogeneous Multi-Core System-On-Chip; Manufacturer: Aries Alectronics Inc.; Manufacturer Part Num: 23017; Part Class: Connectors; .checked_Footprint: 140604-11/scd; Num Pins: 64 (+9)
YW1 = SIT-OSC32KHZ-SIT1533AC-H5-DCC-32.768: 20 ppm, Ultra-Low Power 32.768 kHz Quartz XTAL Replacement; Current - Supply (max): 1.3uA; ComponentLink1URL: http://www.sitime.com/products/datasheets/sit1533/SiT1533-datasheet.pdf; ComponentLink1Description: Datasheet; Frequency: 32.768kHz; Supplier 1: Digi-Key; Supplier Part Number 1: 1473-1515-2-ND; Supplier 2: Digi-Key; Supplier Part Number 2: 1473-1515-1-ND; Supplier 3: Digi-Key; Supplier Part Number 3: 1473-1515-6-ND; Supplier 4: Digi-Key; Supplier Part Number 4: 1473-1516-2-ND; Supplier 5: Digi-Key; Supplier Part Number 5: 1473-1516-1-ND; Supplier 6: Digi-Key; Supplier Part Number 6: 1473-1516-6-ND; Supplier 7: Digi-Key; Supplier Part Number 7: SIT1533AC-H5-DCC-32.768S-ND; Supplier 8: Digi-Key; Supplier Part Number 8: SIT1533AC-H5-DCC-32.768D-ND

## Sheet FlexEMG_v0r0_SF2-POWER.SchDoc
size A3
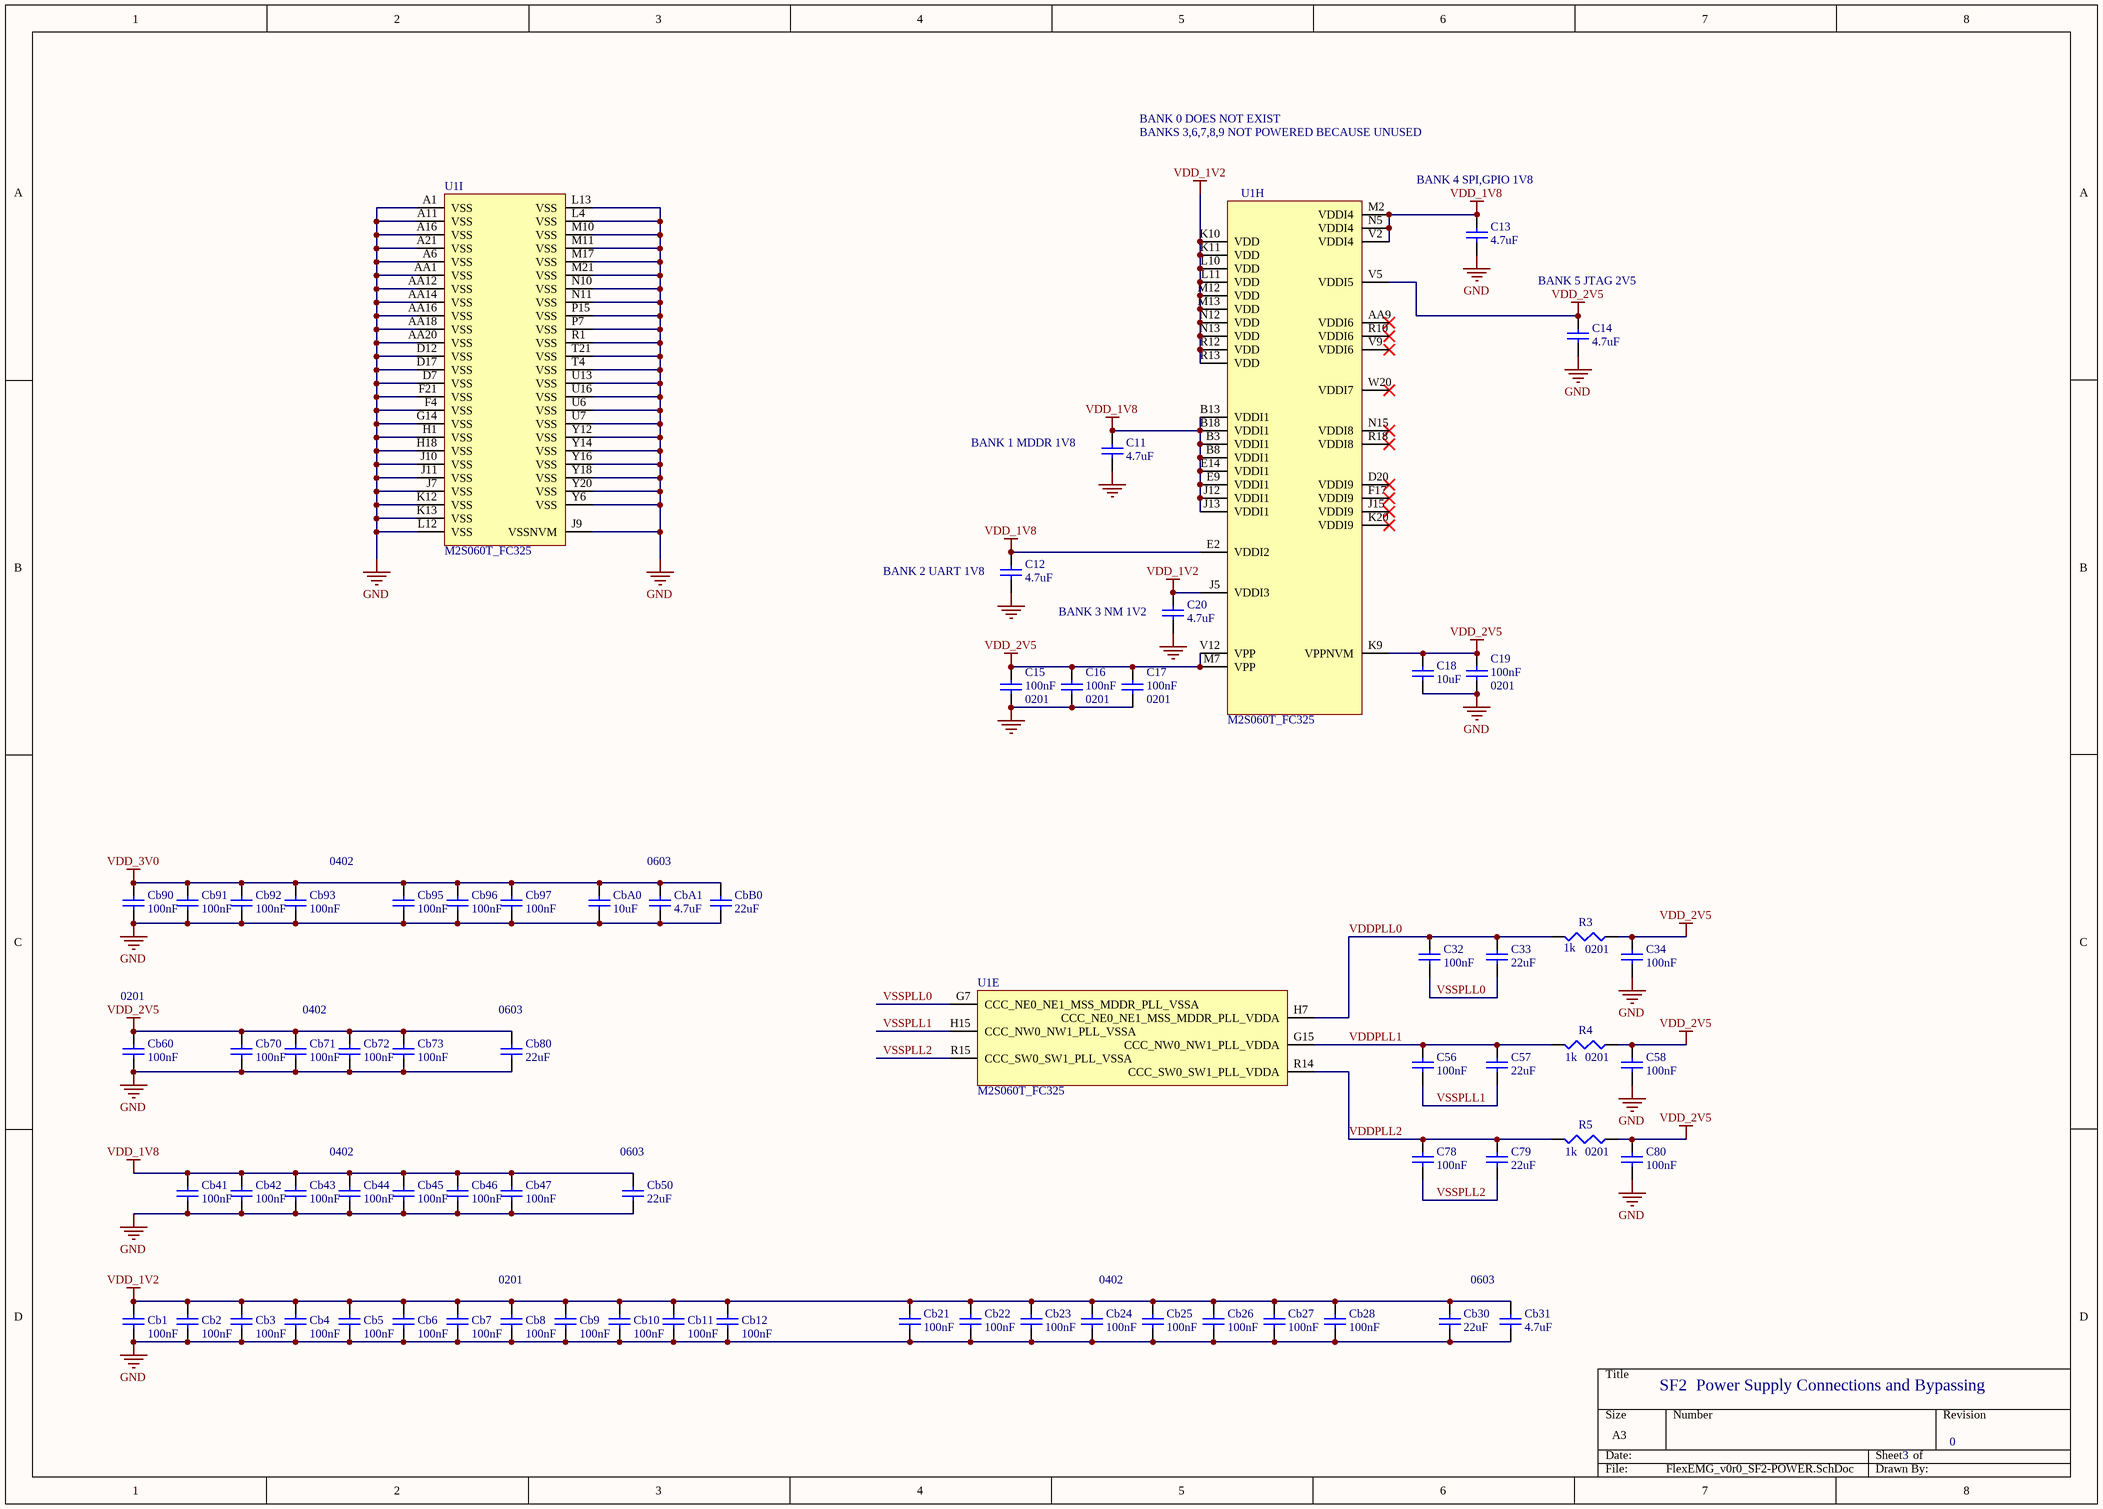
[diagram p2: FlexEMG_v0r0_SF2-POWER.SchDoc]

### Parts
C11  value 4.7uF  [c0603-Murata-GR]  (hidden comment: GRM188R6YA475KE15D)
C12  value 4.7uF  [c0603-Murata-GR]  (hidden comment: GRM188R6YA475KE15D)
C13  value 4.7uF  [c0603-Murata-GR]  (hidden comment: GRM188R6YA475KE15D)
C14  value 4.7uF  [c0603-Murata-GR]  (hidden comment: GRM188R6YA475KE15D)
C15  value 100nF  Package: 0201  [c0201-Murata-GR]  (hidden comment: GRM033R6YA104KE14D)
C16  value 100nF  Package: 0201  [c0201-Murata-GR]  (hidden comment: GRM033R6YA104KE14D)
C17  value 100nF  Package: 0201  [c0201-Murata-GR]  (hidden comment: GRM033R6YA104KE14D)
C18  value 10uF  [c0603-Murata-GR]  (hidden comment: GRM188R61E106MA73D)
C19  value 100nF  Package: 0201  [c0201-Murata-GR]  (hidden comment: GRM033R6YA104KE14D)
C20  value 4.7uF  [c0603-Murata-GR]  (hidden comment: GRM188R6YA475KE15D)
C32  value 100nF  [c0402-Murata-GR]  (hidden comment: GRM155R61H104KE19D)
C33  value 22uF  [c0603-Murata-GR]  (hidden comment: GRM187R61A226ME15D)
C34  value 100nF  [c0402-Murata-GR]  (hidden comment: GRM155R61H104KE19D)
C56  value 100nF  [c0402-Murata-GR]  (hidden comment: GRM155R61H104KE19D)
C57  value 22uF  [c0603-Murata-GR]  (hidden comment: GRM187R61A226ME15D)
C58  value 100nF  [c0402-Murata-GR]  (hidden comment: GRM155R61H104KE19D)
C78  value 100nF  [c0402-Murata-GR]  (hidden comment: GRM155R61H104KE19D)
C79  value 22uF  [c0603-Murata-GR]  (hidden comment: GRM187R61A226ME15D)
C80  value 100nF  [c0402-Murata-GR]  (hidden comment: GRM155R61H104KE19D)
Cb1  value 100nF  [c0201-Murata-GR]  (hidden comment: GRM033R6YA104KE14D)
Cb2  value 100nF  [c0201-Murata-GR]  (hidden comment: GRM033R6YA104KE14D)
Cb3  value 100nF  [c0201-Murata-GR]  (hidden comment: GRM033R6YA104KE14D)
Cb4  value 100nF  [c0201-Murata-GR]  (hidden comment: GRM033R6YA104KE14D)
Cb5  value 100nF  [c0201-Murata-GR]  (hidden comment: GRM033R6YA104KE14D)
Cb6  value 100nF  [c0201-Murata-GR]  (hidden comment: GRM033R6YA104KE14D)
Cb7  value 100nF  [c0201-Murata-GR]  (hidden comment: GRM033R6YA104KE14D)
Cb8  value 100nF  [c0201-Murata-GR]  (hidden comment: GRM033R6YA104KE14D)
Cb9  value 100nF  [c0201-Murata-GR]  (hidden comment: GRM033R6YA104KE14D)
Cb10  value 100nF  [c0201-Murata-GR]  (hidden comment: GRM033R6YA104KE14D)
Cb11  value 100nF  [c0201-Murata-GR]  (hidden comment: GRM033R6YA104KE14D)
Cb12  value 100nF  [c0201-Murata-GR]  (hidden comment: GRM033R6YA104KE14D)
Cb21  value 100nF  [c0402-Murata-GR]  (hidden comment: GRM155R61H104KE19D)
Cb22  value 100nF  [c0402-Murata-GR]  (hidden comment: GRM155R61H104KE19D)
Cb23  value 100nF  [c0402-Murata-GR]  (hidden comment: GRM155R61H104KE19D)
Cb24  value 100nF  [c0402-Murata-GR]  (hidden comment: GRM155R61H104KE19D)
Cb25  value 100nF  [c0402-Murata-GR]  (hidden comment: GRM155R61H104KE19D)
Cb26  value 100nF  [c0402-Murata-GR]  (hidden comment: GRM155R61H104KE19D)
Cb27  value 100nF  [c0402-Murata-GR]  (hidden comment: GRM155R61H104KE19D)
Cb28  value 100nF  [c0402-Murata-GR]  (hidden comment: GRM155R61H104KE19D)
Cb30  value 22uF  [c0603-Murata-GR]  (hidden comment: GRM187R61A226ME15D)
Cb31  value 4.7uF  [c0603-Murata-GR]  (hidden comment: GRM188R6YA475KE15D)
Cb41  value 100nF  [c0402-Murata-GR]  (hidden comment: GRM155R61H104KE19D)
Cb42  value 100nF  [c0402-Murata-GR]  (hidden comment: GRM155R61H104KE19D)
Cb43  value 100nF  [c0402-Murata-GR]  (hidden comment: GRM155R61H104KE19D)
Cb44  value 100nF  [c0402-Murata-GR]  (hidden comment: GRM155R61H104KE19D)
Cb45  value 100nF  [c0402-Murata-GR]  (hidden comment: GRM155R61H104KE19D)
Cb46  value 100nF  [c0402-Murata-GR]  (hidden comment: GRM155R61H104KE19D)
Cb47  value 100nF  [c0402-Murata-GR]  (hidden comment: GRM155R61H104KE19D)
Cb50  value 22uF  [c0603-Murata-GR]  (hidden comment: GRM187R61A226ME15D)
Cb60  value 100nF  [c0201-Murata-GR]  (hidden comment: GRM033R6YA104KE14D)
Cb70  value 100nF  [c0402-Murata-GR]  (hidden comment: GRM155R61H104KE19D)
Cb71  value 100nF  [c0402-Murata-GR]  (hidden comment: GRM155R61H104KE19D)
Cb72  value 100nF  [c0402-Murata-GR]  (hidden comment: GRM155R61H104KE19D)
Cb73  value 100nF  [c0402-Murata-GR]  (hidden comment: GRM155R61H104KE19D)
Cb80  value 22uF  [c0603-Murata-GR]  (hidden comment: GRM187R61A226ME15D)
Cb90  value 100nF  [c0402-Murata-GR]  (hidden comment: GRM155R61H104KE19D)
Cb91  value 100nF  [c0402-Murata-GR]  (hidden comment: GRM155R61H104KE19D)
Cb92  value 100nF  [c0402-Murata-GR]  (hidden comment: GRM155R61H104KE19D)
Cb93  value 100nF  [c0402-Murata-GR]  (hidden comment: GRM155R61H104KE19D)
Cb95  value 100nF  [c0402-Murata-GR]  (hidden comment: GRM155R61H104KE19D)
Cb96  value 100nF  [c0402-Murata-GR]  (hidden comment: GRM155R61H104KE19D)
Cb97  value 100nF  [c0402-Murata-GR]  (hidden comment: GRM155R61H104KE19D)
CbA0  value 10uF  [c0603-Murata-GR]  (hidden comment: GRM188R61E106MA73D)
CbA1  value 4.7uF  [c0603-Murata-GR]  (hidden comment: GRM188R6YA475KE15D)
CbB0  value 22uF  [c0603-Murata-GR]  (hidden comment: GRM187R61A226ME15D)
R3  value 1k  Package: 0201  [0201_p]  (hidden comment: ERJ-1GEF1001C)
R4  value 1k  Package: 0201  [0201_p]  (hidden comment: ERJ-1GEF1001C)
R5  value 1k  Package: 0201  [0201_p]  (hidden comment: ERJ-1GEF1001C)
U1  M2S060T_FC325  [MCSM-CS-325]  (parts E,H,I of 9)

### Nets
GND: C11.1 C12.1 C13.1 C14.1 C15.1 C16.1 C17.1 C18.1 C19.1 C20.1 C34.1 C58.1 C80.1 Cb1.1 Cb2.1 Cb3.1 Cb4.1 Cb5.1 Cb6.1 Cb7.1 Cb8.1 Cb9.1 Cb10.1 Cb11.1 Cb12.1 Cb21.1 Cb22.1 Cb23.1 Cb24.1 Cb25.1 Cb26.1 Cb27.1 Cb28.1 Cb30.1 Cb31.1 Cb41.1 Cb42.1 Cb43.1 Cb44.1 Cb45.1 Cb46.1 Cb47.1 Cb50.1 Cb60.1 Cb70.1 Cb71.1 Cb72.1 Cb73.1 Cb80.1 Cb90.1 Cb91.1 Cb92.1 Cb93.1 Cb95.1 Cb96.1 Cb97.1 CbA0.1 CbA1.1 CbB0.1 U1.A1(VSS) U1.A6(VSS) U1.A11(VSS) U1.A16(VSS) U1.A21(VSS) U1.AA1(VSS) U1.AA12(VSS) U1.AA14(VSS) U1.AA16(VSS) U1.AA18(VSS) U1.AA20(VSS) U1.D7(VSS) U1.D12(VSS) U1.D17(VSS) U1.F4(VSS) U1.F21(VSS) U1.G14(VSS) U1.H1(VSS) U1.H18(VSS) U1.J7(VSS) U1.J9(VSSNVM) U1.J10(VSS) U1.J11(VSS) U1.K12(VSS) U1.K13(VSS) U1.L4(VSS) U1.L12(VSS) U1.L13(VSS) U1.M10(VSS) U1.M11(VSS) U1.M17(VSS) U1.M21(VSS) U1.N10(VSS) U1.N11(VSS) U1.P7(VSS) U1.P15(VSS) U1.R1(VSS) U1.T4(VSS) U1.T21(VSS) U1.U6(VSS) U1.U7(VSS) U1.U13(VSS) U1.U16(VSS) U1.Y6(VSS) U1.Y12(VSS) U1.Y14(VSS) U1.Y16(VSS) U1.Y18(VSS) U1.Y20(VSS)
VDD_1V2: C20.2 Cb1.2 Cb2.2 Cb3.2 Cb4.2 Cb5.2 Cb6.2 Cb7.2 Cb8.2 Cb9.2 Cb10.2 Cb11.2 Cb12.2 Cb21.2 Cb22.2 Cb23.2 Cb24.2 Cb25.2 Cb26.2 Cb27.2 Cb28.2 Cb30.2 Cb31.2 U1.J5(VDDI3) U1.K10(VDD) U1.K11(VDD) U1.L10(VDD) U1.L11(VDD) U1.M12(VDD) U1.M13(VDD) U1.N12(VDD) U1.N13(VDD) U1.R12(VDD) U1.R13(VDD)
VDD_1V8: C11.2 C12.2 C13.2 Cb41.2 Cb42.2 Cb43.2 Cb44.2 Cb45.2 Cb46.2 Cb47.2 Cb50.2 U1.B3(VDDI1) U1.B8(VDDI1) U1.B13(VDDI1) U1.B18(VDDI1) U1.E2(VDDI2) U1.E9(VDDI1) U1.E14(VDDI1) U1.J12(VDDI1) U1.J13(VDDI1) U1.M2(VDDI4) U1.N5(VDDI4) U1.V2(VDDI4)
VDD_2V5: C14.2 C15.2 C16.2 C17.2 C18.2 C19.2 C34.2 C58.2 C80.2 Cb60.2 Cb70.2 Cb71.2 Cb72.2 Cb73.2 Cb80.2 R3.1 R4.1 R5.1 U1.K9(VPPNVM) U1.M7(VPP) U1.V5(VDDI5) U1.V12(VPP)
VDD_3V0: Cb90.2 Cb91.2 Cb92.2 Cb93.2 Cb95.2 Cb96.2 Cb97.2 CbA0.2 CbA1.2 CbB0.2
VDDPLL0: C32.2 C33.2 R3.2 U1.H7(CCC_NE0_NE1_MSS_MDDR_PLL_VDDA)
VDDPLL1: C56.2 C57.2 R4.2 U1.G15(CCC_NW0_NW1_PLL_VDDA)
VDDPLL2: C78.2 C79.2 R5.2 U1.R14(CCC_SW0_SW1_PLL_VDDA)
VSSPLL0: C32.1 C33.1 U1.G7(CCC_NE0_NE1_MSS_MDDR_PLL_VSSA)
VSSPLL1: C56.1 C57.1 U1.H15(CCC_NW0_NW1_PLL_VSSA)
VSSPLL2: C78.1 C79.1 U1.R15(CCC_SW0_SW1_PLL_VSSA)

Not connected (* = marked no-connect by the designer): U1 AA9(VDDI6)* D20(VDDI9)* F17(VDDI9)* J15(VDDI9)* K20(VDDI9)* N15(VDDI8)* R10(VDDI6)* R18(VDDI8)* V9(VDDI6)* W20(VDDI7)*

### Notes on the sheet
- BANKS 3,6,7,8,9 NOT POWERED BECAUSE UNUSED
- BANK 0 DOES NOT EXIST
- BANK 4 SPI,GPIO 1V8
- (near C14) BANK 5 JTAG 2V5
- (near C11) BANK 1 MDDR 1V8
- (near C12) BANK 2 UART 1V8
- BANK 3 NM 1V2
- 0402
- (near CbA1) 0603
- (near Cb60) 0201
- (near Cb80) 0603
- (near Cb50) 0603
- (near Cb8) 0201
- 0603
- SF2  Power Supply Connections and Bypassing
- 3
- 0

### Library data of the parts
C11-C14 C20 Cb31 CbA1 = Cap: CAP CER 4.7UF 35V X5R 0603; Manufacturer: Murata; Supplier: Digikey; Supplier PN: 490-7205-1-ND; Manufacturer PN: GRM188R6YA475KE15D
C15-C17 C19 Cb1-Cb12 Cb60 = Cap: as Cd2 on sheet FlexEMG_v0r0_SF2_DDR; Supplier PN: 490-10430-1-ND; Supplier: Digikey; Manufacturer PN: GRM033R6YA104KE14D
C18 CbA0 = Cap: as Cd1 on sheet FlexEMG_v0r0_SF2_DDR; Supplier: Digikey; Supplier PN: 490-7202-1-ND; Manufacturer PN: GRM188R61E106MA73D
C32 C34 C56 C58 C78 C80 Cb21-Cb28 Cb41-Cb47 Cb70-Cb73 Cb90-Cb93 Cb95-Cb97 = Cap: CAP CER 0.1UF 50V X5R 0402; Manufacturer: Murata; Supplier: Digikey; Manufacturer PN: GRM155R61H104KE19D; Supplier PN: 490-11917-1-ND
C33 C57 C79 Cb30 Cb50 Cb80 CbB0 = Cap: CAP CER 22UF 10V X5R 0603; Manufacturer: Murata; Note: 10V X5R 20%; Supplier: Digikey; Supplier PN: 490-13243-1-ND; Manufacturer PN: GRM187R61A226ME15D
R3-R5 = Resistor: as Rc3 on sheet FlexEMG_v0r0_SF2-COMM; Manufacturer PN: ERJ-1GEF1001C; Supplier: Digikey; Supplier P/N: P1.00KABCT-ND; Power: 1/20W
U1 = M2S060T_FC325: as U1 on sheet FlexEMG_v0r0_SF2-COMM; Supplier: Future; Supplier PN: M2S060T-FCSG325I

## Sheet FlexEMG_v0r0_SF2_unused.SchDoc
size B
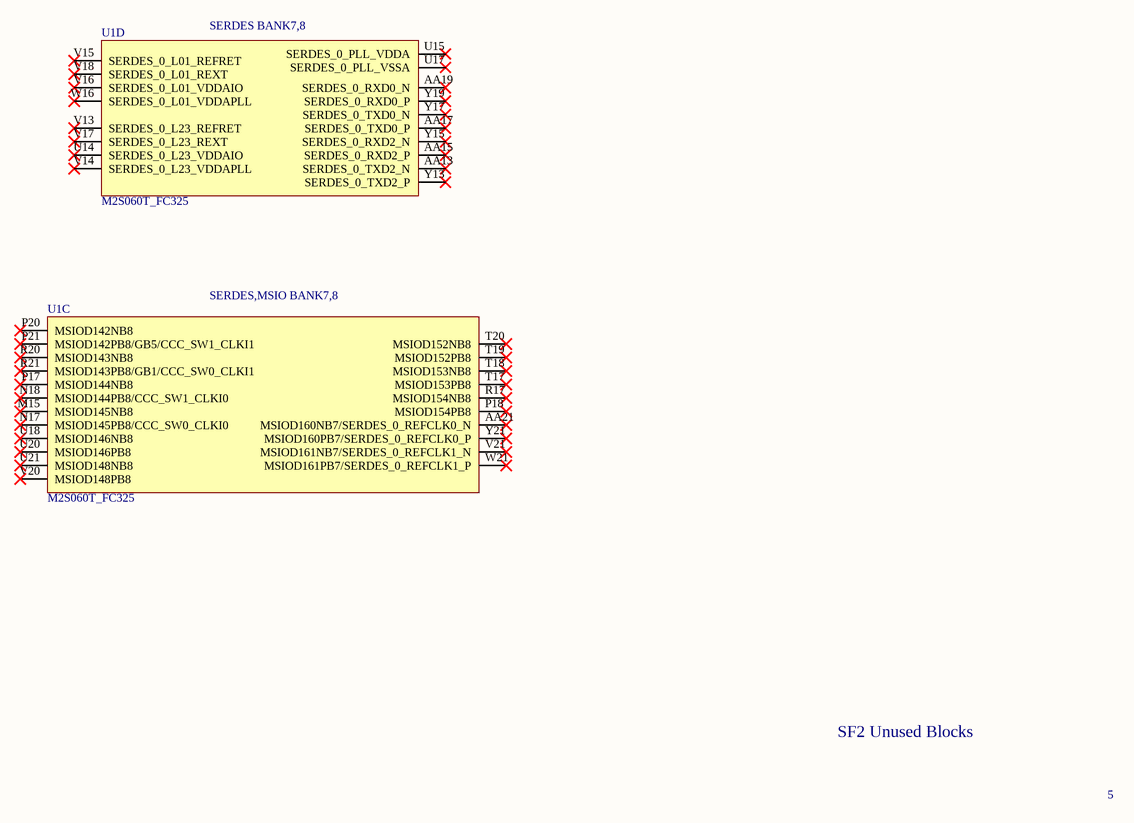
[diagram p3: FlexEMG_v0r0_SF2_unused.SchDoc]

### Parts
U1  M2S060T_FC325  [MCSM-CS-325]  (parts C,D of 9)

### Nets

Not connected (* = marked no-connect by the designer): U1 AA13(SERDES_0_TXD2_N)* AA15(SERDES_0_RXD2_P)* AA17(SERDES_0_TXD0_P)* AA19(SERDES_0_RXD0_N)* AA21(MSIOD160NB7/SERDES_0_REFCLK0_N)* M15(MSIOD145NB8)* N17(MSIOD145PB8/CCC_SW0_CLKI0)* N18(MSIOD144PB8/CCC_SW1_CLKI0)* P17(MSIOD144NB8)* P18(MSIOD154PB8)* P20(MSIOD142NB8)* P21(MSIOD142PB8/GB5/CCC_SW1_CLKI1)* R17(MSIOD154NB8)* R20(MSIOD143NB8)* R21(MSIOD143PB8/GB1/CCC_SW0_CLKI1)* T17(MSIOD153PB8)* T18(MSIOD153NB8)* T19(MSIOD152PB8)* T20(MSIOD152NB8)* U14(SERDES_0_L23_VDDAIO)* U15(SERDES_0_PLL_VDDA)* U17(SERDES_0_PLL_VSSA)* U18(MSIOD146NB8)* U20(MSIOD146PB8)* U21(MSIOD148NB8)* V13(SERDES_0_L23_REFRET)* V14(SERDES_0_L23_VDDAPLL)* V15(SERDES_0_L01_REFRET)* V16(SERDES_0_L01_VDDAIO)* V17(SERDES_0_L23_REXT)* V18(SERDES_0_L01_REXT)* V20(MSIOD148PB8)* V21(MSIOD161NB7/SERDES_0_REFCLK1_N)* W16(SERDES_0_L01_VDDAPLL)* W21(MSIOD161PB7/SERDES_0_REFCLK1_P)* Y13(SERDES_0_TXD2_P)* Y15(SERDES_0_RXD2_N)* Y17(SERDES_0_TXD0_N)* Y19(SERDES_0_RXD0_P)* Y21(MSIOD160PB7/SERDES_0_REFCLK0_P)*

### Notes on the sheet
- (near U1) SERDES BANK7,8
- (near U1) SERDES,MSIO BANK7,8
- SF2 Unused Blocks
- 5

### Library data of the parts
U1 = M2S060T_FC325: as U1 on sheet FlexEMG_v0r0_SF2-COMM; Supplier: Future; Supplier PN: M2S060T-FCSG325I

## Sheet FlexEMG_v0r0_RADIO.SchDoc
size A3
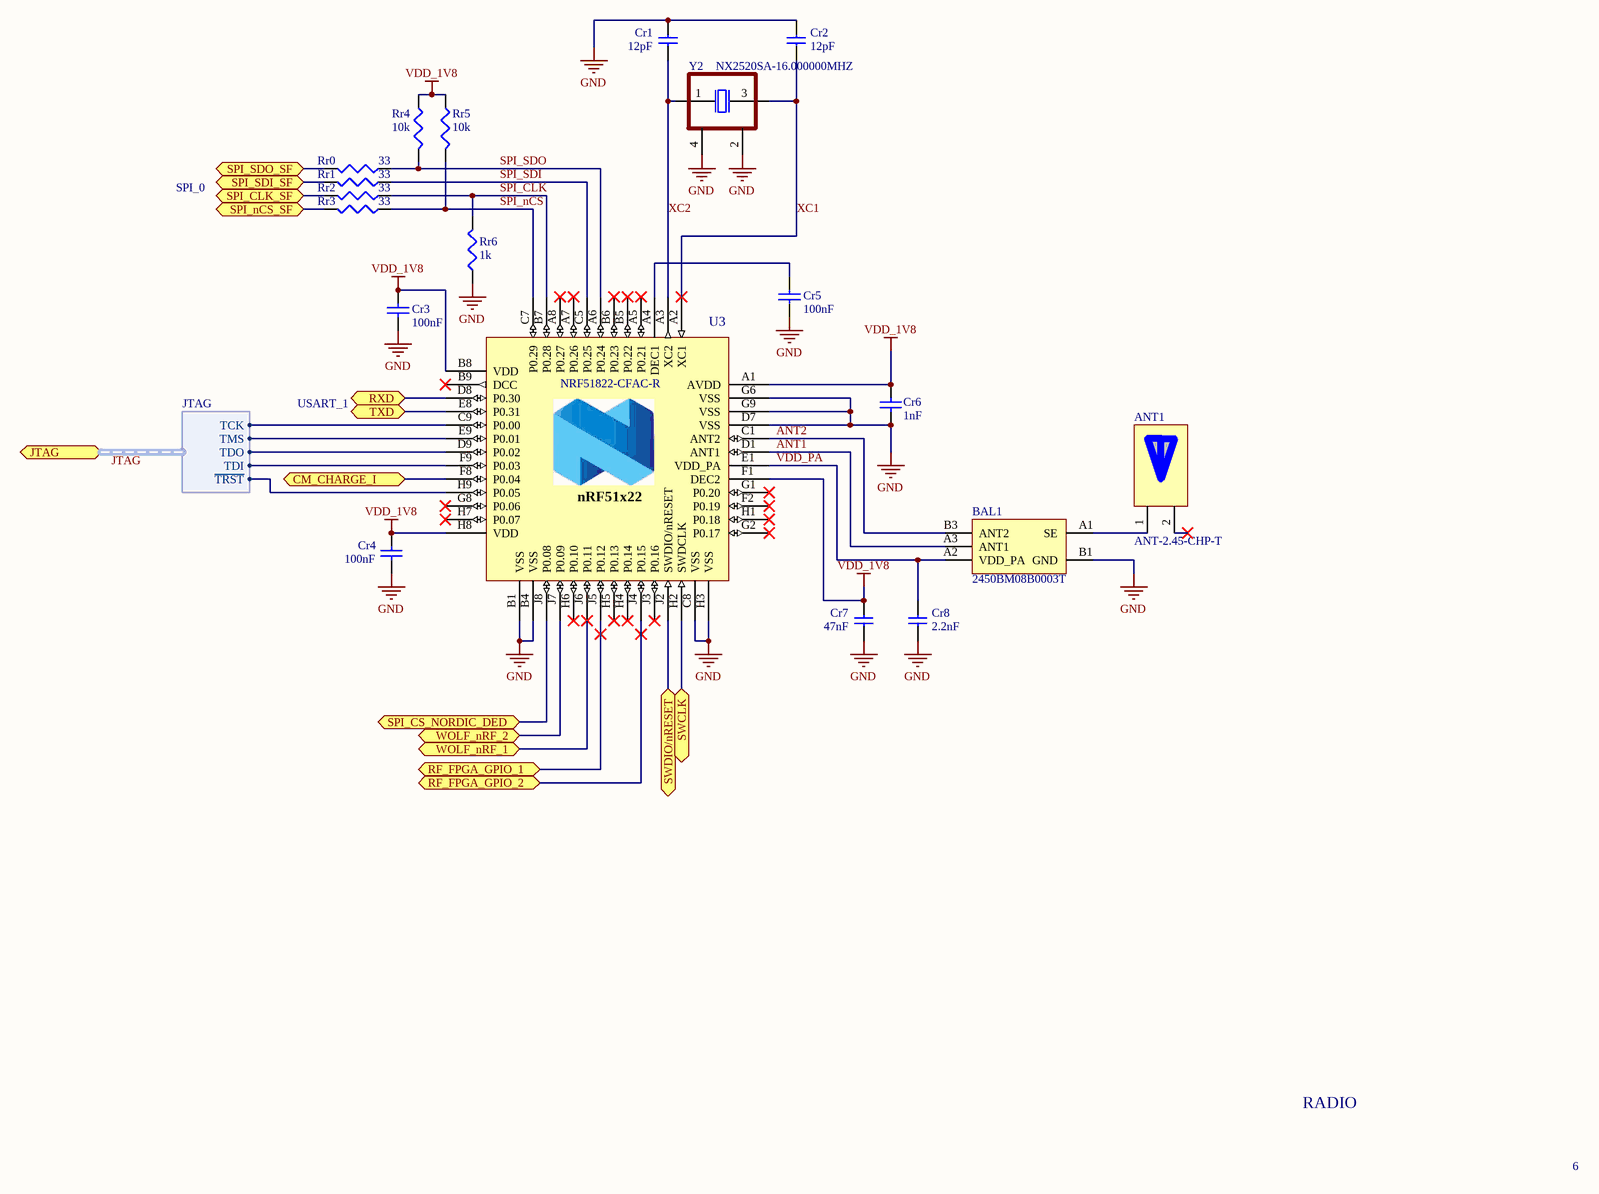
[diagram p4: FlexEMG_v0r0_RADIO.SchDoc]

### Parts
ANT1  ANT-2.45-CHP-T  [ANTENNACHIP]
BAL1  2450BM08B0003T  [BALUN_PACKAGE]
Cr1  value 12pF  [c0402-Murata-GR]  (hidden comment: GRM1555C1H120FA01D)
Cr2  value 12pF  [c0402-Murata-GR]  (hidden comment: GRM1555C1H120FA01D)
Cr3  value 100nF  [0402_ss]  (hidden comment: GRM033R6YA104KE14D)
Cr4  value 100nF  [c0402-Murata-GR]  (hidden comment: GRM155R61H104KE19D)
Cr5  value 100nF  [0201]  (hidden comment: GRM033R6YA104KE14D)
Cr6  value 1nF  [c0402-Murata-GR]  (hidden comment: GRM155R61H102KA01D)
Cr7  value 47nF  [c0402-Murata-GR]  (hidden comment: GRM155R71E473KA88D)
Cr8  value 2.2nF  [c0402-Murata-GR]
Rr0  value 33  [0201]  (hidden comment: ERJ-PA2J330X)
Rr1  value 33  [0201]  (hidden comment: ERJ-PA2J330X)
Rr2  value 33  [0201]  (hidden comment: ERJ-PA2J330X)
Rr3  value 33  [0201]  (hidden comment: ERJ-PA2J330X)
Rr4  value 10k  [0201]  (hidden comment: ERJ-2RKF1002X)
Rr5  value 10k  [0402_p]  (hidden comment: ERJ-2RKF1002X)
Rr6  value 1k  [0201]  (hidden comment: ERJ-2RKF1001X)
U3  NRF51822-CFAC-R  [BGA_NORDIC]
Y2  NX2520SA-16.000000MHZ  [XOSC_4PIN]

### Ports
CM_CHARGE_I (bidir), JTAG (harness JTAG), RF_FPGA_GPIO_1 (bidir), RF_FPGA_GPIO_2 (bidir), RXD (bidir), SPI_CLK_SF (bidir), SPI_CS_NORDIC_DED (bidir), SPI_nCS_SF (bidir), SPI_SDI_SF (bidir), SPI_SDO_SF (bidir), SWCLK (bidir), SWDIO/nRESET (bidir), TXD (bidir), WOLF_nRF_1 (bidir), WOLF_nRF_2 (bidir)

### Harnesses
JTAG: ~{TRST}, TCK, TMS, TDI, TDO

### Nets
GND: BAL1.B1(GND) Cr1.2 Cr2.2 Cr3.1 Cr4.1 Cr5.1 Cr6.2 Cr7.1 Cr8.1 Rr6.1 U3.B1(VSS) U3.B4(VSS) U3.C8(VSS) U3.D7(VSS) U3.G6(VSS) U3.G9(VSS) U3.H3(VSS) Y2.2(GND) Y2.4(GND)
VDD_1V8: Cr3.2 Cr4.2 Cr6.1 Cr7.2 Rr4.1 Rr5.1 U3.A1(AVDD) U3.B8(VDD) U3.F1(DEC2) U3.H8(VDD)
ANT1: BAL1.A3(ANT1) U3.D1(ANT1)
ANT2: BAL1.B3(ANT2) U3.C1(ANT2)
CM_charge_I: U3.F8(P0.04) ; port CM_CHARGE_I
DRDY_NRF: U3.J7(P0.09) ; port WOLF_nRF_2
DRDY_OUT: U3.J6(P0.11) ; port WOLF_nRF_1
JTAG.~{TRST}: U3.H9(P0.05) ; port JTAG.~{TRST}
JTAG.TCK: U3.C9(P0.00) ; port JTAG.TCK
JTAG.TDI: U3.F9(P0.03) ; port JTAG.TDI
JTAG.TDO: U3.D9(P0.02) ; port JTAG.TDO
JTAG.TMS: U3.E9(P0.01) ; port JTAG.TMS
RXD: U3.D8(P0.30) ; port RXD
SPI_CLK: Rr2.1 Rr6.2 U3.B7(P0.28)
SPI_CLK_SF: Rr2.2 ; port SPI_CLK_SF
SPI_nCS: Rr3.1 Rr5.2 U3.C7(P0.29)
SPI_nCS_SF: Rr3.2 ; port SPI_nCS_SF
SPI_SDI: Rr1.1 U3.C5(P0.25)
SPI_SDI_SF: Rr1.2 ; port SPI_SDI_SF
SPI_SDO: Rr0.1 Rr4.2 U3.A6(P0.24)
SPI_SDO_SF: Rr0.2 ; port SPI_SDO_SF
SWCLK: U3.H2(SWDCLK) ; port SWCLK
SWDIO: U3.J2(SWDIO/nRESET) ; port SWDIO/nRESET
TXD: U3.E8(P0.31) ; port TXD
VDD_PA: BAL1.A2(VDD_PA) Cr8.2 U3.E1(VDD_PA)
XC1: Cr2.1 U3.A2(XC1) Y2.3(out)
XC2: Cr1.1 U3.A3(XC2) Y2.1(inp)
NetANT1_1: ANT1.1(IN) BAL1.A1(SE)
NetCr5_2: Cr5.2 U3.A4(DEC1)
NetU1_G4: U3.J5(P0.12) ; port RF_FPGA_GPIO_1
NetU1_G5: U3.J4(P0.15) ; port RF_FPGA_GPIO_2
NetU2_36: U3.J8(P0.08) ; port SPI_CS_NORDIC_DED

Not connected (* = marked no-connect by the designer): ANT1 2(NC)*; U3 A5(P0.21)* A7(P0.26)* A8(P0.27)* B5(P0.22)* B6(P0.23)* B9(DCC)* F2(P0.19)* G1(P0.20)* G2(P0.17)* G8(P0.06)* H1(P0.18)* H4(P0.14)* H5(P0.13)* H6(P0.10)* H7(P0.07)* J3(P0.16)*

### Buses and harness runs
harness JTAG = port JTAG

### Notes on the sheet
- SPI_0
- USART_1
- RADIO
- 6
- (in symbol nRF51822) nRF51x22

### Library data of the parts
ANT1 = Linx ANT-2.45-CHP-x: ANT 2.4GHZ 802.11 BLUETOOTH SMD; Manufacturer: Linx; Supplier PN: ANT-2.45-CHPCT-ND; Supplier: Digikey; Manufacturer PN: ANT-2.45-CHP-T
BAL1 = BAL_NRF02D3: BALUN 2.4GHZ; Manufacturer: Johnson; Supplier PN: 712-1582-1-ND; Supplier: Digikey; Manufacturer PN: 2450BM08B0003T
Cr1 Cr2 = CAP_0402: as Cc1 on sheet FlexEMG_v0r0_SF2-COMM; Supplier: Digikey; Manufacturer PN: GRM1555C1H120FA01D; Supplier PN: 490-6196-1-ND
Cr3 Cr5 = Cap: as Cd2 on sheet FlexEMG_v0r0_SF2_DDR; Supplier PN: 490-10430-1-ND; Supplier: Digikey; Manufacturer PN: GRM033R6YA104KE14D
Cr4 = Cap: as C32 on sheet FlexEMG_v0r0_SF2-POWER; Supplier: Digikey; Manufacturer PN: GRM155R61H104KE19D; Supplier PN: 490-11917-1-ND
Cr6 = Cap: CAP CER 1000PF 50V X5R 0402; Manufacturer: Murata; Supplier: Digikey; Supplier PN: 490-6316-1-ND; Manufacturer PN: GRM155R61H102KA01D
Cr7 = CAP_0402: CAP CER 0.047UF 25V X7R 0402 10%; Manufacturer: Murata; Supplier: Digikey; Manufacturer PN: GRM155R71E473KA88D; Supplier PN: 490-3254-1-ND
Cr8 = CAP_0402: CAP CER 2200PF 50V X7R 0402; Manufacturer: Murata; Manufacturer PN: GRM155R71H222JA01J; Supplier: Digikey; Supplier PN: 490-6359-1-ND
Rr0-Rr3 = Resistor: as Rc6 on sheet FlexEMG_v0r0_SF2-COMM; Manufacturer PN: ERJ-PA2J330X; Supplier: Digikey; Supplier P/N: P17184CT-ND; Package: 0402
Rr4 Rr5 = Resistor: RES SMD 10K OHM 1% 1/10W 0402; Manufacturer: Panasonic; Manufacturer PN: ERJ-2RKF1002X; Supplier: Digikey; Supplier P/N: P10.0KLCT-ND; Power: 1/10W; Package: 0402
Rr6 = Resistor: as Rc7 on sheet FlexEMG_v0r0_SF2-COMM; Manufacturer PN: ERJ-2RKF1001X; Supplier: Digikey; Supplier P/N: P1.00KLCT-ND; Power: 1/10W; Package: 0402
U3 = nRF51822: IC SOC 2.4GHZ MULTIPROTO 62WLCS; Manufacturer: Nordic; Manufacturer PN: NRF51822-CFAC-R; Supplier: Digikey; Supplier PN: 1490-1041-1-ND
Y2 = XOSC: CRYSTAL 16.0000MHZ 10PF SMD; Manufacturer: NDK; Supplier PN: 644-1059-1-ND; Supplier: Digikey; Manufacturer PN: NX2520SA-16.000000MHZ

## Sheet FlexEMG_v0r0_NM.SchDoc
size B
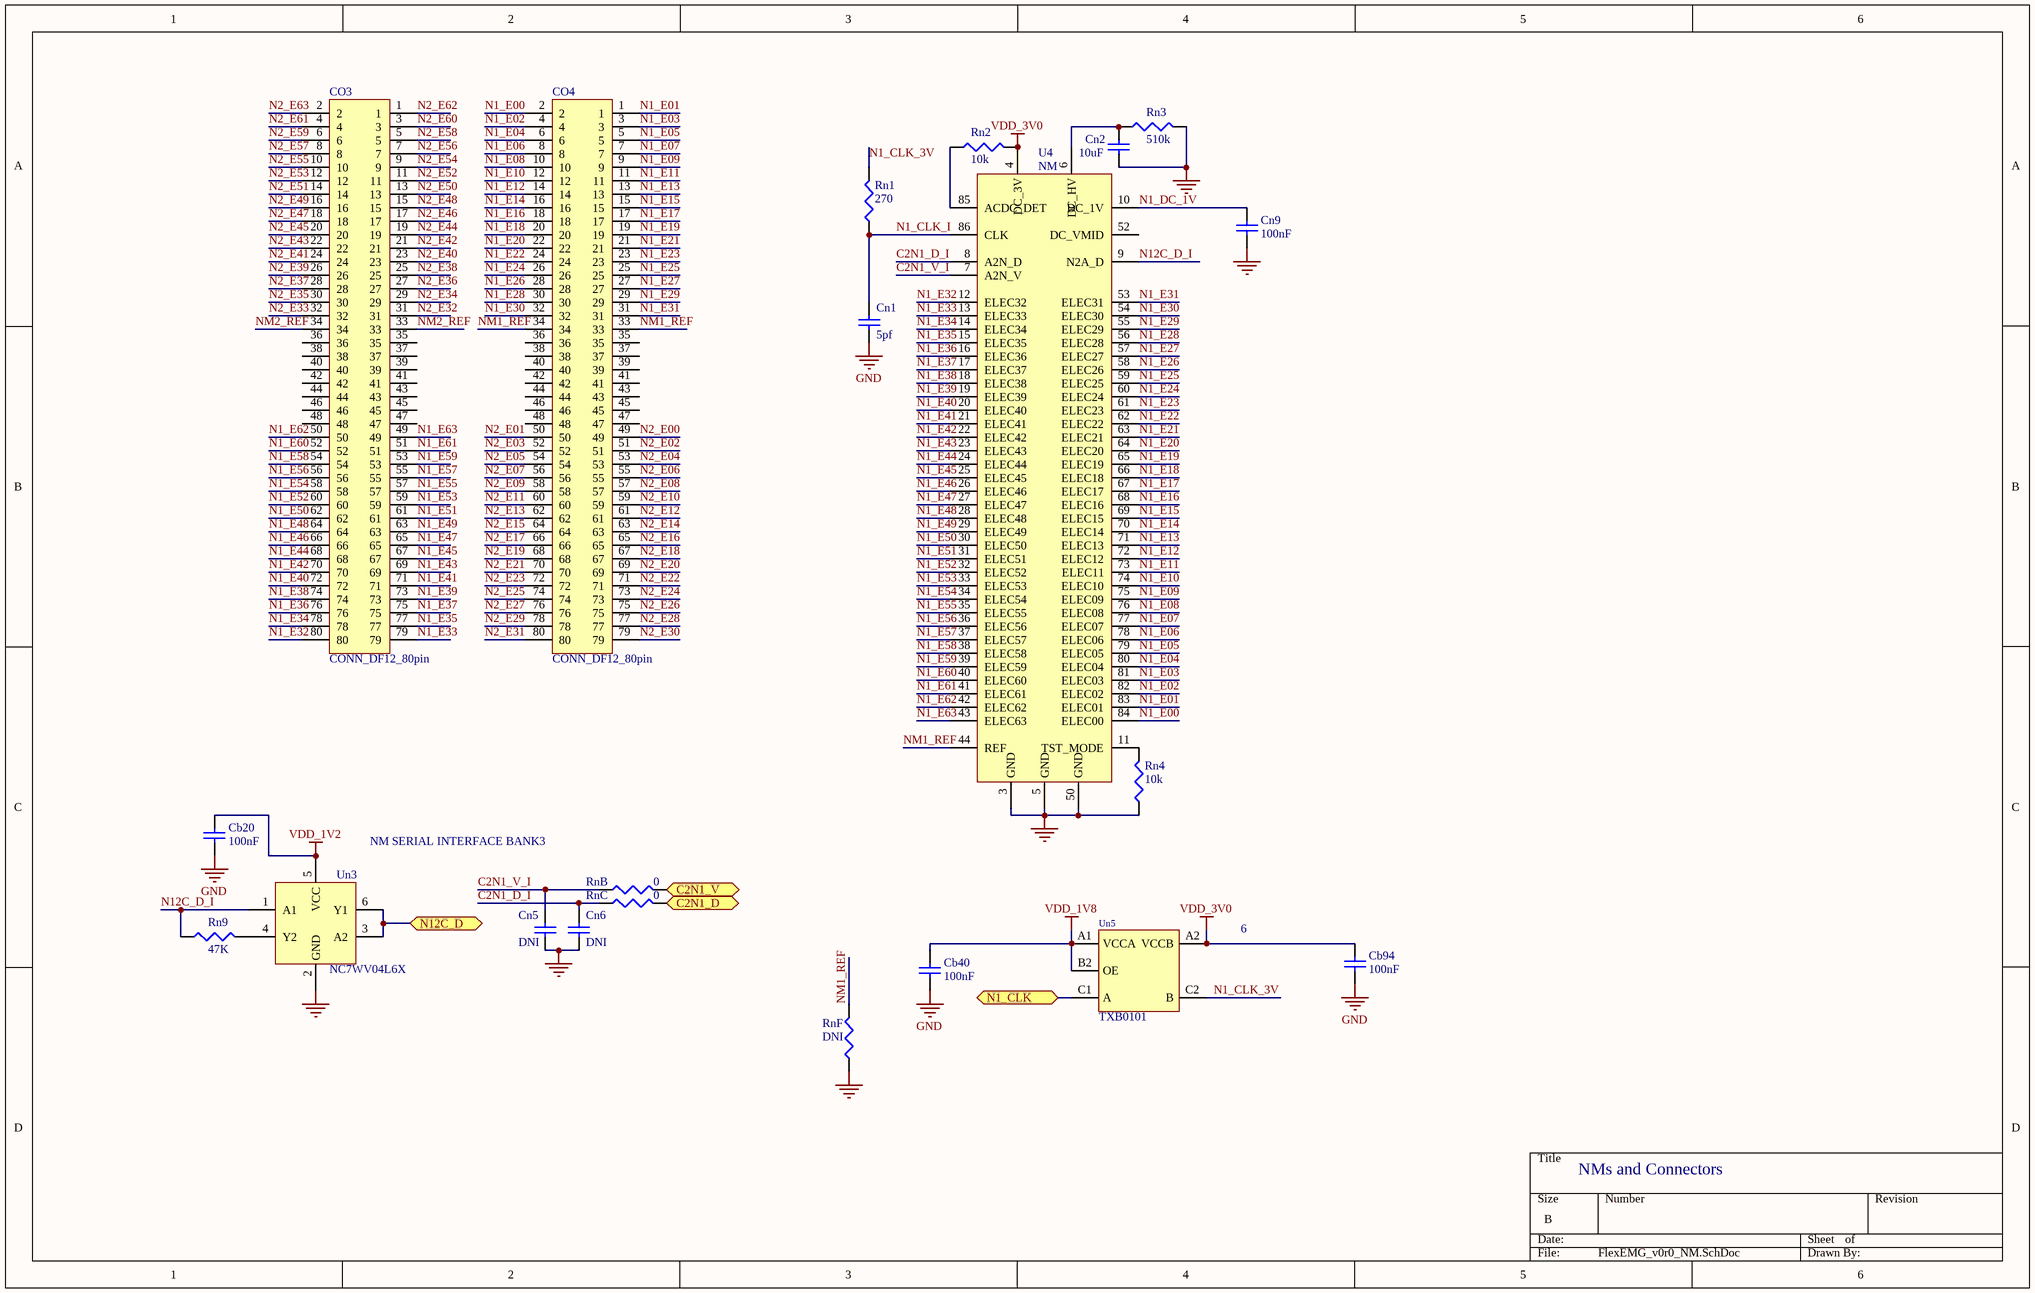
[diagram p5: FlexEMG_v0r0_NM.SchDoc]

### Parts
Cb20  value 100nF  [c0402-Murata-GR]  (hidden comment: GRM155R61H104KE19D)
Cb40  value 100nF  [c0402-Murata-GR]  (hidden comment: GRM155R61H104KE19D)
Cb94  value 100nF  [c0402-Murata-GR]  (hidden comment: GRM155R61H104KE19D)
Cn1  value 5pf  [c0402-Murata-GR]  (hidden comment: GRM1555C1H5R0BA01D)
Cn2  value 10uF  [c0603-Murata-GR]  (hidden comment: GRM188R61E106MA73D)
Cn5  DNI  [c0402-Murata-GR]
Cn6  DNI  [c0402-Murata-GR]
Cn9  value 100nF  [c0402-Murata-GR]  (hidden comment: GRM155R61H104KE19D)
CO3  CONN_DF12_80pin  [CONN_DF12(3.0)-80DP_bottom]
CO4  CONN_DF12_80pin  [CONN_DF12(3.0)-80DP_bottom]
Rn1  value 270  [0402_p]  (hidden comment: ERJ-2RKF2700X)
Rn2  value 10k  [0402_p]  (hidden comment: ERJ-2RKF1002X)
Rn3  value 510k  [0402_p]  (hidden comment: ERJ-2RKF5103X)
Rn4  value 10k  [0402_p]  (hidden comment: ERJ-2RKF1002X)
Rn9  value 47K  [0402_p]  (hidden comment: ERJ-2RKF4702X)
RnB  value 0  [0402_p]  (hidden comment: ERJ-2GE0R00X)
RnC  value 0  [0402_p]  (hidden comment: ERJ-2GE0R00X)
RnF  DNI  [0402_p]
U4  NM  [NMv2]
Un3  NC7WV04L6X  [6micropak]
Un5  TXB0101  [YZP6-ti]

### Ports
C2N1_D (bidir), C2N1_V (bidir), N1_CLK (bidir), N12C_D (bidir)

### Nets
GND: Cb20.1 Cb40.1 Cb94.1 Cn1.1 Cn2.1 Cn5.1 Cn6.1 Cn9.1 Rn3.2 Rn4.1 RnF.1 U4.3(GND) U4.5(GND) U4.50(GND) Un3.2(GND) Un5.B1(GND)
VDD_1V2: Cb20.2 Un3.5(VCC)
VDD_1V8: Cb40.2 Un5.A1(VCCA) Un5.B2(OE)
VDD_3V0: Cb94.2 Rn2.2 U4.4(DC_3V) Un5.A2(VCCB)
C2N1_D: RnC.2 ; port C2N1_D
C2N1_D_I: Cn6.2 RnC.1 U4.8(A2N_D)
C2N1_V: RnB.2 ; port C2N1_V
C2N1_V_I: Cn5.2 RnB.1 U4.7(A2N_V)
N1_CLK: Un5.C1(A) ; port N1_CLK
N1_CLK_3V: Rn1.2 Un5.C2(B)
N1_CLK_I: Cn1.2 Rn1.1 U4.86(CLK)
N1_DC_1V: Cn9.2 U4.10(DC_1V)
N1_E00: CO4.2 U4.84(ELEC00)
N1_E01: CO4.1 U4.83(ELEC01)
N1_E02: CO4.4 U4.82(ELEC02)
N1_E03: CO4.3 U4.81(ELEC03)
N1_E04: CO4.6 U4.80(ELEC04)
N1_E05: CO4.5 U4.79(ELEC05)
N1_E06: CO4.8 U4.78(ELEC06)
N1_E07: CO4.7 U4.77(ELEC07)
N1_E08: CO4.10 U4.76(ELEC08)
N1_E09: CO4.9 U4.75(ELEC09)
N1_E10: CO4.12 U4.74(ELEC10)
N1_E11: CO4.11 U4.73(ELEC11)
N1_E12: CO4.14 U4.72(ELEC12)
N1_E13: CO4.13 U4.71(ELEC13)
N1_E14: CO4.16 U4.70(ELEC14)
N1_E15: CO4.15 U4.69(ELEC15)
N1_E16: CO4.18 U4.68(ELEC16)
N1_E17: CO4.17 U4.67(ELEC17)
N1_E18: CO4.20 U4.66(ELEC18)
N1_E19: CO4.19 U4.65(ELEC19)
N1_E20: CO4.22 U4.64(ELEC20)
N1_E21: CO4.21 U4.63(ELEC21)
N1_E22: CO4.24 U4.62(ELEC22)
N1_E23: CO4.23 U4.61(ELEC23)
N1_E24: CO4.26 U4.60(ELEC24)
N1_E25: CO4.25 U4.59(ELEC25)
N1_E26: CO4.28 U4.58(ELEC26)
N1_E27: CO4.27 U4.57(ELEC27)
N1_E28: CO4.30 U4.56(ELEC28)
N1_E29: CO4.29 U4.55(ELEC29)
N1_E30: CO4.32 U4.54(ELEC30)
N1_E31: CO4.31 U4.53(ELEC31)
N1_E32: CO3.80 U4.12(ELEC32)
N1_E33: CO3.79 U4.13(ELEC33)
N1_E34: CO3.78 U4.14(ELEC34)
N1_E35: CO3.77 U4.15(ELEC35)
N1_E36: CO3.76 U4.16(ELEC36)
N1_E37: CO3.75 U4.17(ELEC37)
N1_E38: CO3.74 U4.18(ELEC38)
N1_E39: CO3.73 U4.19(ELEC39)
N1_E40: CO3.72 U4.20(ELEC40)
N1_E41: CO3.71 U4.21(ELEC41)
N1_E42: CO3.70 U4.22(ELEC42)
N1_E43: CO3.69 U4.23(ELEC43)
N1_E44: CO3.68 U4.24(ELEC44)
N1_E45: CO3.67 U4.25(ELEC45)
N1_E46: CO3.66 U4.26(ELEC46)
N1_E47: CO3.65 U4.27(ELEC47)
N1_E48: CO3.64 U4.28(ELEC48)
N1_E49: CO3.63 U4.29(ELEC49)
N1_E50: CO3.62 U4.30(ELEC50)
N1_E51: CO3.61 U4.31(ELEC51)
N1_E52: CO3.60 U4.32(ELEC52)
N1_E53: CO3.59 U4.33(ELEC53)
N1_E54: CO3.58 U4.34(ELEC54)
N1_E55: CO3.57 U4.35(ELEC55)
N1_E56: CO3.56 U4.36(ELEC56)
N1_E57: CO3.55 U4.37(ELEC57)
N1_E58: CO3.54 U4.38(ELEC58)
N1_E59: CO3.53 U4.39(ELEC59)
N1_E60: CO3.52 U4.40(ELEC60)
N1_E61: CO3.51 U4.41(ELEC61)
N1_E62: CO3.50 U4.42(ELEC62)
N1_E63: CO3.49 U4.43(ELEC63)
N2_E00: CO4.49
N2_E01: CO4.50
N2_E02: CO4.51
N2_E03: CO4.52
N2_E04: CO4.53
N2_E05: CO4.54
N2_E06: CO4.55
N2_E07: CO4.56
N2_E08: CO4.57
N2_E09: CO4.58
N2_E10: CO4.59
N2_E11: CO4.60
N2_E12: CO4.61
N2_E13: CO4.62
N2_E14: CO4.63
N2_E15: CO4.64
N2_E16: CO4.65
N2_E17: CO4.66
N2_E18: CO4.67
N2_E19: CO4.68
N2_E20: CO4.69
N2_E21: CO4.70
N2_E22: CO4.71
N2_E23: CO4.72
N2_E24: CO4.73
N2_E25: CO4.74
N2_E26: CO4.75
N2_E27: CO4.76
N2_E28: CO4.77
N2_E29: CO4.78
N2_E30: CO4.79
N2_E31: CO4.80
N2_E32: CO3.31
N2_E33: CO3.32
N2_E34: CO3.29
N2_E35: CO3.30
N2_E36: CO3.27
N2_E37: CO3.28
N2_E38: CO3.25
N2_E39: CO3.26
N2_E40: CO3.23
N2_E41: CO3.24
N2_E42: CO3.21
N2_E43: CO3.22
N2_E44: CO3.19
N2_E45: CO3.20
N2_E46: CO3.17
N2_E47: CO3.18
N2_E48: CO3.15
N2_E49: CO3.16
N2_E50: CO3.13
N2_E51: CO3.14
N2_E52: CO3.11
N2_E53: CO3.12
N2_E54: CO3.9
N2_E55: CO3.10
N2_E56: CO3.7
N2_E57: CO3.8
N2_E58: CO3.5
N2_E59: CO3.6
N2_E60: CO3.3
N2_E61: CO3.4
N2_E62: CO3.1
N2_E63: CO3.2
N12C_D: Un3.3(A2) Un3.6(Y1) ; port N12C_D
N12C_D_I: Rn9.1 U4.9(N2A_D) Un3.1(A1)
NM1_REF: CO4.33 CO4.34 RnF.2 U4.44(REF)
NM2_REF: CO3.33 CO3.34
NetCn2_2: Cn2.2 Rn3.1 U4.6(DC_HV)
NetRn2_1: Rn2.1 U4.85(ACDC_DET)
NetRn4_2: Rn4.2 U4.11(TST_MODE)
NetRn9_2: Rn9.2 Un3.4(Y2)

Not connected (* = marked no-connect by the designer): CO3 35 36 37 38 39 40 41 42 43 44 45 46 47 48; CO4 35 36 37 38 39 40 41 42 43 44 45 46 47 48; U4 1(AC_PWR+) 2(AC_PWR-) 45(COUNT) 46(PAC) 47(A_TST_HV) 48(A_TST_BG) 49(A_TEST) 51(D_TEST) 52(DC_VMID)

### Notes on the sheet
- (near Un3) NM SERIAL INTERFACE BANK3
- 6
- NMs and Connectors

### Library data of the parts
Cb20 Cb40 Cb94 Cn9 = Cap: as C32 on sheet FlexEMG_v0r0_SF2-POWER; Supplier: Digikey; Manufacturer PN: GRM155R61H104KE19D; Supplier PN: 490-11917-1-ND
Cn1 = Cap: CAP CER 5PF 50V NP0 0402 +-0.1pf; Manufacturer: Murata; Supplier: Digikey; Manufacturer PN: GRM1555C1H5R0BA01D; Supplier PN: 490-8213-1-ND
Cn2 = Cap: as Cd1 on sheet FlexEMG_v0r0_SF2_DDR; Supplier: Digikey; Manufacturer PN: GRM188R61E106MA73D; Supplier PN: 490-7202-1-ND
Cn5 Cn6 = Cap: Capacitor; Supplier: Digikey; Manufacturer PN: DNI
CO3 CO4 = CONN_DF12_80pin: CONN HEADER 80POS 3MM SMD 0.5MM; Manufacturer PN: DF12(3.0)-80DP-0.5V; Manufacturer: Hirose; Supplier PN: H5225CT-ND; Supplier: Digikey
Rn1 = Resistor: RES SMD 270 OHM 1% 1/10W 0402; Manufacturer: Panasonic; Manufacturer PN: ERJ-2RKF2700X; Supplier: Digikey; Supplier P/N: P270LCT-ND; Power: 1/10W; Package: 0402
Rn2 Rn4 = Resistor: as Rr4 on sheet FlexEMG_v0r0_RADIO; Manufacturer PN: ERJ-2RKF1002X; Supplier: Digikey; Supplier P/N: P10.0KLCT-ND; Power: 1/10W; Package: 0402
Rn3 = Resistor: RES SMD 499K OHM 1% 1/10W 0402; Manufacturer: Panasonic; Manufacturer PN: ERJ-2RKF5103X; Supplier: Digikey; Supplier P/N: P510KLCT-ND; Power: 1/10W; Package: 0402; Note: 1%
Rn9 = Resistor: RES SMD 47K OHM 1% 1/10W 0402; Manufacturer: Panasonic; Manufacturer PN: ERJ-2RKF4702X; Supplier: Digikey; Supplier P/N: P47.0KLCT-ND; Power: 1/10W; Package: 0402
RnB RnC = Resistor: as Rc4 on sheet FlexEMG_v0r0_SF2-COMM; Manufacturer PN: ERJ-2GE0R00X; Supplier: Digikey; Power: 1/10W; Supplier P/N: P0.0JCT-ND; Package: 0402
RnF = Resistor: Manufacturer: Panasonic; Power: 1/10W; Manufacturer PN: DNI; Supplier: Digikey; Package: 0402
U4 = NM: Neuromodulator; Manufacturer: Cortera; Manufacturer PN: Custom
Un3 = Dual Inverter: IC INVERTER ULP-A DUAL 6MICROPAK; Manufacturer: Fairchild; Manufacturer PN: NC7WV04L6X; Supplier: Digikey; Supplier PN: NC7WV04L6XCT-ND
Un5 = TXB0101: Single level converter; Manufacturer PN: TXB0101YZPR; Manufacturer: TI; Supplier PN: 296-21927-1-ND; Supplier: Digikey

## Sheet FlexEMG_v0r0_ACCEL.SchDoc
size A
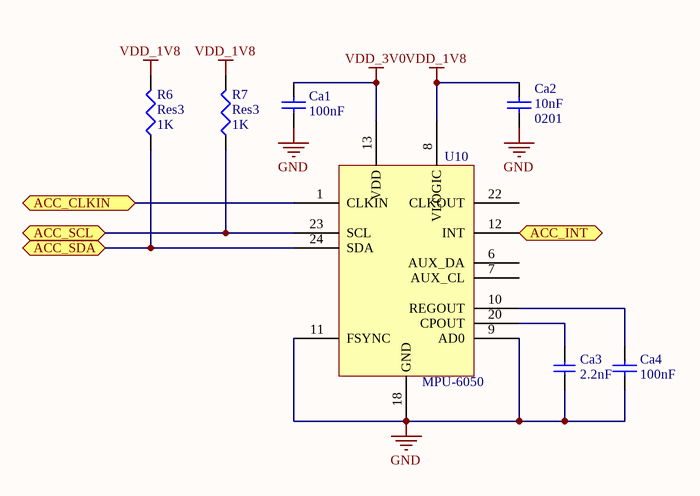
[diagram p6: FlexEMG_v0r0_ACCEL.SchDoc]

### Parts
Ca1  value 100nF  [c0402-Murata-GR]  (hidden comment: GRM155R61H104KE19D)
Ca2  0201  value 10nF  [c0201-Murata-GR]
Ca3  value 2.2nF  [c0402-Murata-GR]
Ca4  value 100nF  [c0402-Murata-GR]  (hidden comment: GRM155R61H104KE19D)
R6  Res3  value 1K  [0402_ss]
R7  Res3  value 1K  [0402_ss]
U10  MPU-6050  [QFN-24]

### Ports
ACC_CLKIN, ACC_INT, ACC_SCL, ACC_SDA

### Nets
GND: Ca1.1 Ca2.1 Ca3.1 Ca4.1 U10.0(CEN) U10.9(AD0) U10.11(FSYNC) U10.18(GND)
VDD_1V8: Ca2.2 R6.2 R7.2 U10.8(VLOGIC)
VDD_3V0: Ca1.2 U10.13(VDD)
ACC_CLKIN: U10.1(CLKIN) ; port ACC_CLKIN
ACC_INT: U10.12(INT) ; port ACC_INT
ACC_SCL: R7.1 U10.23(SCL) ; port ACC_SCL
ACC_SDA: R6.1 U10.24(SDA) ; port ACC_SDA
NetCa3_2: Ca3.2 U10.20(CPOUT)
NetCa4_2: Ca4.2 U10.10(REGOUT)

Not connected (* = marked no-connect by the designer): U10 2(NC) 3(NC) 4(NC) 5(NC) 6(AUX_DA) 7(AUX_CL) 14(NC) 15(NC) 16(NC) 17(NC) 19(RESV) 21(RESV) 22(CLKOUT)

### Library data of the parts
Ca1 Ca4 = Cap: as C32 on sheet FlexEMG_v0r0_SF2-POWER; Supplier: Digikey; Manufacturer PN: GRM155R61H104KE19D; Supplier PN: 490-11917-1-ND
Ca2 = Cap: as Cc3 on sheet FlexEMG_v0r0_SF2-COMM; Supplier: Digikey; Supplier PN: 490-7194-1-ND
Ca3 = CAP_0402: as Cr8 on sheet FlexEMG_v0r0_RADIO; Supplier: Digikey; Supplier PN: 490-6359-1-ND
R6 R7 = Res3: Resistor; Published: 8-Jun-2000; LatestRevisionDate: 29-May-2009; LatestRevisionNote: IPC-7351 Footprint Added.; PackageReference: J1-0603; Publisher: Altium Limited; PackageDescription: Chip Resistor
U10 = MPU-6050: GYRO/ACCELEROMETER 6AXIS 24QFN; Manufacturer: InvenSense; Supplier PN: 1428-1007-1-ND; Supplier: Digikey; Manufacturer PN: MPU-6050